# EAGLE design BMS_Master (EAGLE 6.6.0)

## Sheet 1 of 4: Processor Interface
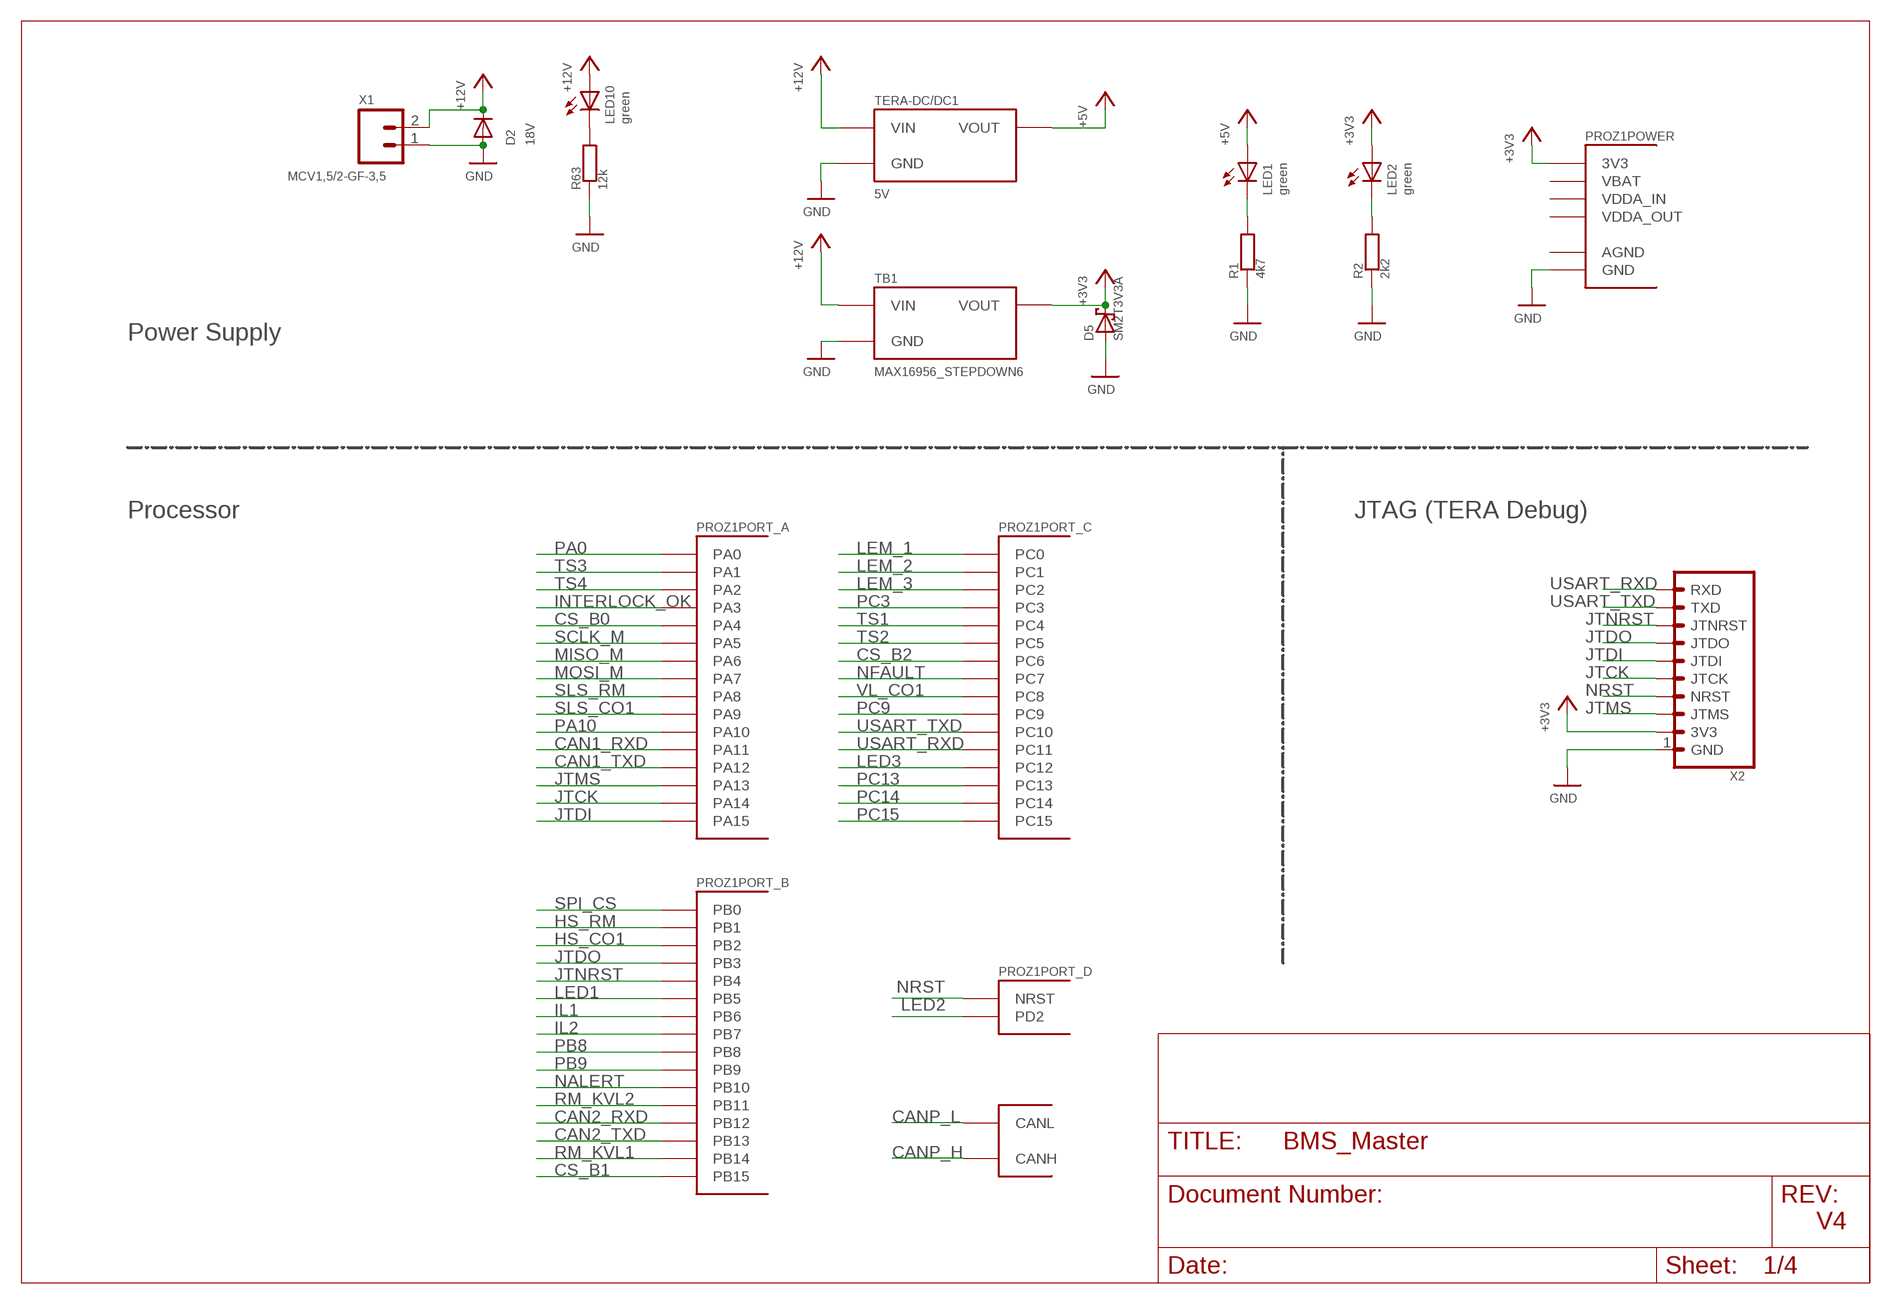
[diagram p0: schematic, sheet 1]

### Parts
D2  18V  DIODE-DO214AA  [DO214AA]
D5  SM2T3V3A  [SM2T3V3A]
LED1  green  LEDCHIP-LED0805  [CHIP-LED0805]
LED2  green  LEDCHIP-LED0805  [CHIP-LED0805]
LED10  green  LEDCHIP-LED0805  [CHIP-LED0805]
PROZ1  STM32F4_PROZESSORBOARDRPZ  [STM32F4_PROZESSORBOARD]
R1  4k7  R  [R0805]
R2  2k2  R  [R0805]
R63  12k  R  [R0805]
TB1  MAX16956_STEPDOWN6  [MAX16956_STEPDOWN6]
TERA-DC/DC1  5V  MAX5035_STEPDOWN3  [MAX5035_STEPDOWN3]
X1  MCV1,5/2-GF-3,5  [MCV1,5/2-GF-3,5]
X2  TERA-PROG-DEBUG-10GERADE  [90130-1110]

### Nets
+3V3: D5.P$2 LED2.A PROZ1.45(POWER:3V3) PROZ1.46(POWER:3V3) TB1.VOUT X2.2(3V3) ; also sheet 2,3
+5V: LED1.A TERA-DC/DC1.VOUT ; also sheet 2,3,4
+12V: D2.C LED10.A TB1.VIN TERA-DC/DC1.VIN X1.2 ; also sheet 2,3,4
CAN1_RXD: PROZ1.26(PORT_A:PA11) ; also sheet 2
CAN1_TXD: PROZ1.24(PORT_A:PA12) ; also sheet 2
CAN2_RXD: PROZ1.50(PORT_B:PB12) ; also sheet 2
CAN2_TXD: PROZ1.49(PORT_B:PB13) ; also sheet 2
CANP_H: PROZ1.31(CAN:CANH) ; also sheet 2
CANP_L: PROZ1.32(CAN:CANL) ; also sheet 2
CS_B0: PROZ1.43(PORT_A:PA4) ; also sheet 2
CS_B1: PROZ1.51(PORT_B:PB15) ; also sheet 2
CS_B2: PROZ1.52(PORT_C:PC6) ; also sheet 2
GND: D2.A D5.P$1 D5.P$11 PROZ1.47(POWER:GND) PROZ1.48(POWER:GND) R1.1 R2.1 R63.1 TB1.GND TB1.GND2(GND) TERA-DC/DC1.GND@1(GND) TERA-DC/DC1.GND@2(GND) X1.1 X2.1(GND) ; also sheet 2,3,4
HS_CO1: PROZ1.36(PORT_B:PB2) ; also sheet 3
HS_RM: PROZ1.37(PORT_B:PB1) ; also sheet 3
IL1: PROZ1.14(PORT_B:PB6) ; also sheet 3
IL2: PROZ1.12(PORT_B:PB7) ; also sheet 3
INTERLOCK_OK: PROZ1.44(PORT_A:PA3) ; also sheet 3
JTCK: PROZ1.18(PORT_A:PA14) X2.5(JTCK)
JTDI: PROZ1.16(PORT_A:PA15) X2.6(JTDI)
JTDO: PROZ1.20(PORT_B:PB3) X2.7(JTDO)
JTMS: PROZ1.59(PORT_A:PA13) X2.3(JTMS)
JTNRST: PROZ1.22(PORT_B:PB4) X2.8(JTNRST)
LED1: PROZ1.25(PORT_B:PB5)
LED2: PROZ1.27(PORT_D:PD2)
LED3: PROZ1.29(PORT_C:PC12)
LEM_1: PROZ1.15(PORT_C:PC0) ; also sheet 4
LEM_2: PROZ1.13(PORT_C:PC1) ; also sheet 4
LEM_3: PROZ1.11(PORT_C:PC2) ; also sheet 4
MISO_M: PROZ1.42(PORT_A:PA6) ; also sheet 2
MOSI_M: PROZ1.41(PORT_A:PA7) ; also sheet 2
N$1: LED1.C R1.2
N$2: LED2.C R2.2
N$54: LED10.C R63.2
NALERT: PROZ1.35(PORT_B:PB10) ; also sheet 2
NFAULT: PROZ1.53(PORT_C:PC7) ; also sheet 2
NRST: PROZ1.17(PORT_D:NRST) X2.4(NRST)
PA0: PROZ1.7(PORT_A:PA0)
PA10: PROZ1.58(PORT_A:PA10)
PB8: PROZ1.10(PORT_B:PB8)
PB9: PROZ1.8(PORT_B:PB9)
PC3: PROZ1.9(PORT_C:PC3)
PC9: PROZ1.55(PORT_C:PC9)
PC13: PROZ1.23(PORT_C:PC13)
PC14: PROZ1.21(PORT_C:PC14)
PC15: PROZ1.19(PORT_C:PC15)
RM_KVL1: PROZ1.33(PORT_B:PB14) ; also sheet 3
RM_KVL2: PROZ1.34(PORT_B:PB11) ; also sheet 3
SCLK_M: PROZ1.60(PORT_A:PA5) ; also sheet 2
SLS_CO1: PROZ1.57(PORT_A:PA9) ; also sheet 3
SLS_RM: PROZ1.56(PORT_A:PA8) ; also sheet 3
SPI_CS: PROZ1.38(PORT_B:PB0) ; also sheet 2
TS1: PROZ1.40(PORT_C:PC4) ; also sheet 4
TS2: PROZ1.39(PORT_C:PC5) ; also sheet 4
TS3: PROZ1.5(PORT_A:PA1) ; also sheet 4
TS4: PROZ1.3(PORT_A:PA2) ; also sheet 4
USART_RXD: PROZ1.30(PORT_C:PC11) X2.10(RXD)
USART_TXD: PROZ1.28(PORT_C:PC10) X2.9(TXD)
VL_CO1: PROZ1.54(PORT_C:PC8) ; also sheet 3
Unconnected: PROZ1.1(POWER:AGND) PROZ1.2(POWER:VDDA_IN) PROZ1.4(POWER:VDDA_OUT) PROZ1.6(POWER:VBAT)

### Notes on the sheet
- Power Supply
- Processor | JTAG (TERA Debug)
- V4

## Sheet 2 of 4: Bus Systems (CAN, SPI)
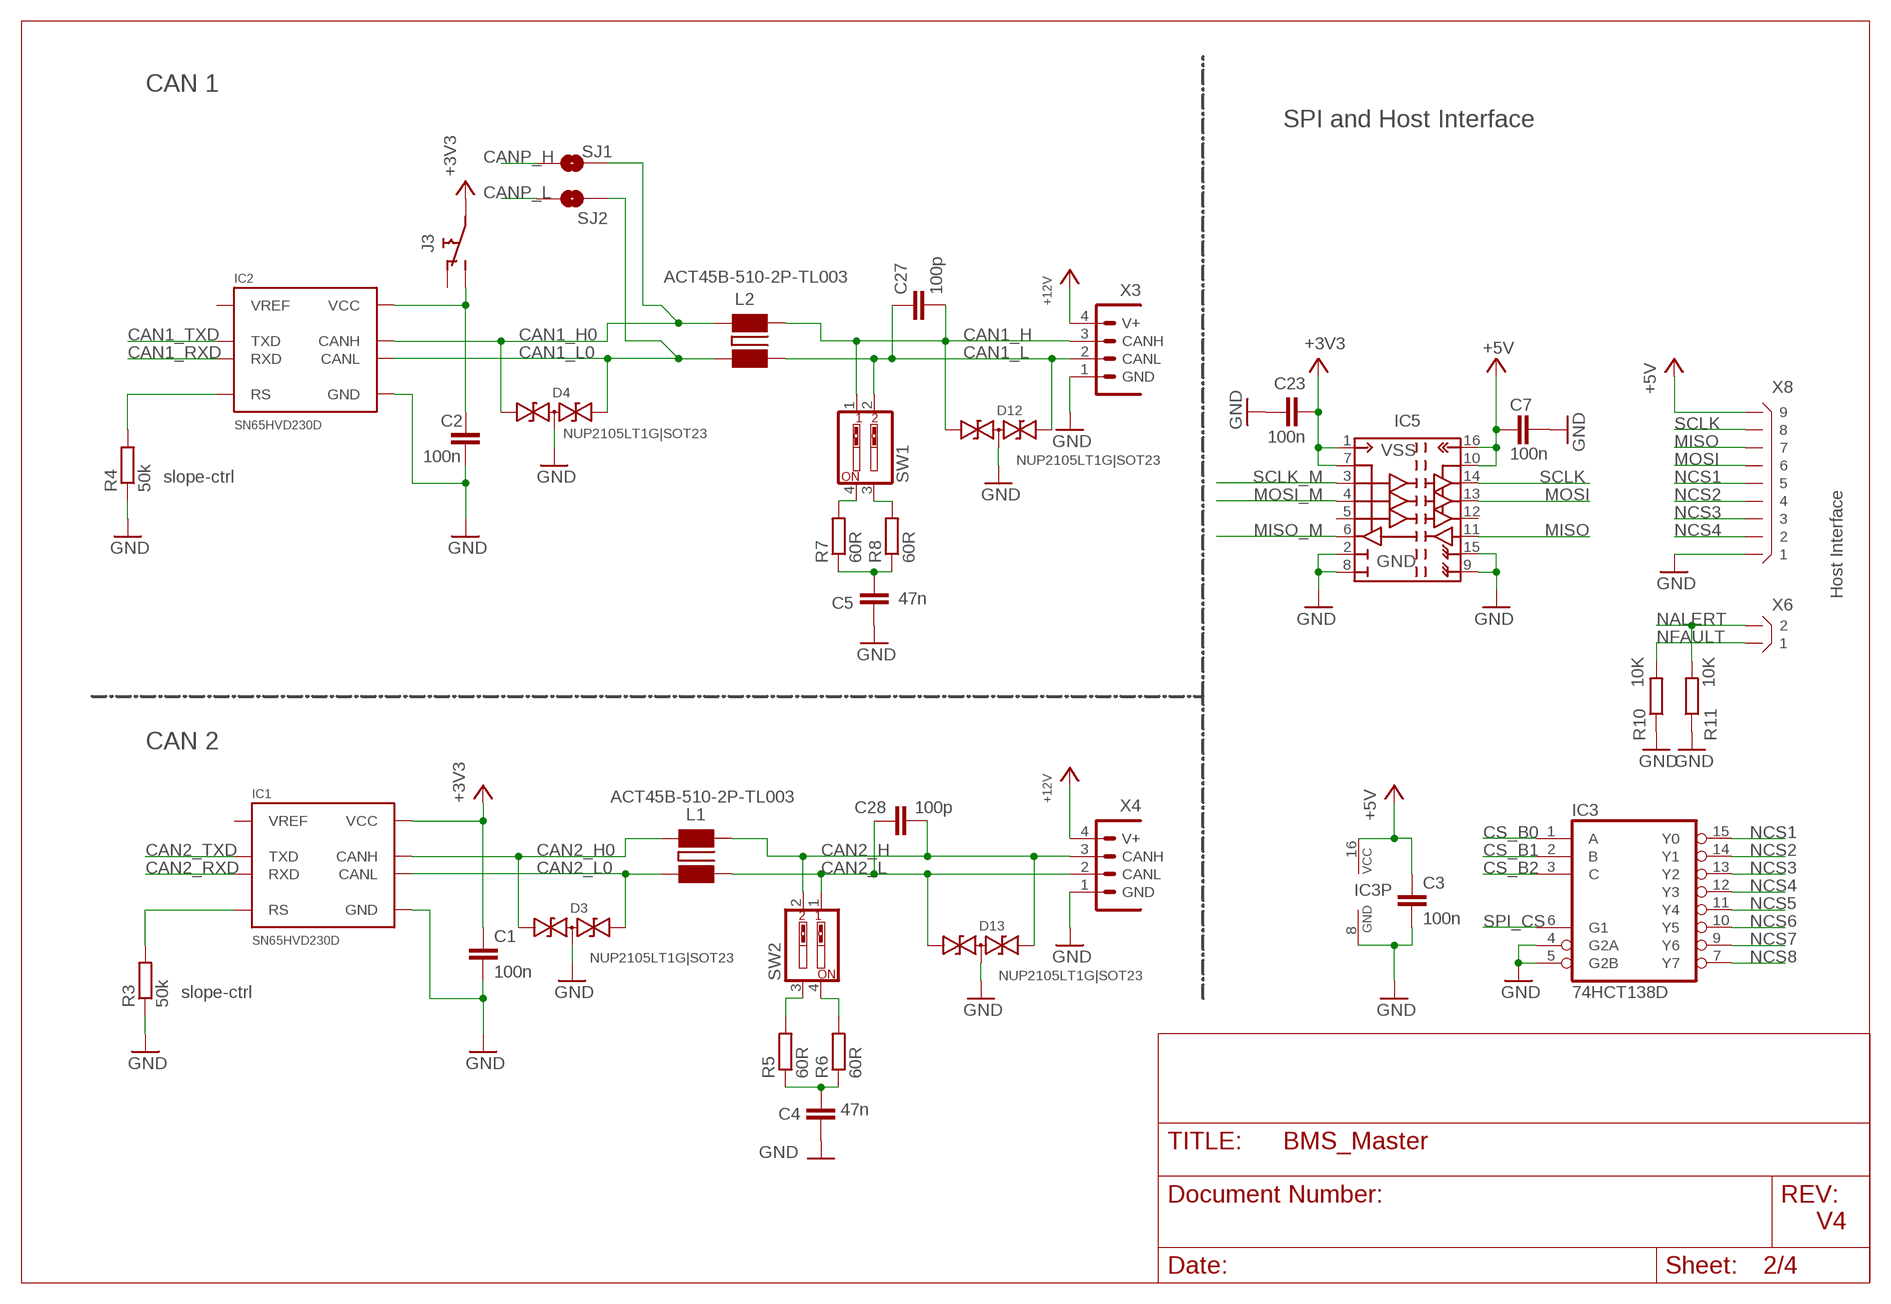
[diagram p1: schematic, sheet 2]

### Parts
C1  100n  C-EUC0805  [C0805]
C2  100n  C-EUC0805  [C0805]
C3  100n  C-EUC0805  [C0805]
C4  47n  C-EUC0603  [C0603]
C5  47n  C-EUC0603  [C0603]
C7  100n  C0603  [C0603]
C23  100n  C0603  [C0603]
C27  100p  C-EUC0603  [C0603]
C28  100p  C-EUC0603  [C0603]
D3  NUP2105LT1G|SOT23  [SOT23]
D4  NUP2105LT1G|SOT23  [SOT23]
D12  NUP2105LT1G|SOT23  [SOT23]
D13  NUP2105LT1G|SOT23  [SOT23]
IC1  SN65HVD230D  [SO08]
IC2  SN65HVD230D  [SO08]
IC3  74HCT138D  [SO16]
IC5  ISO7241  [R-PDSO-G16]
J3  JUMPER_SWITCHS  [J_OR_S]
L1  ACT45B-510-2P-TL003  [ACT45B]
L2  ACT45B-510-2P-TL003  [ACT45B]
R3  50k  R-EU_R0805  [R0805]
R4  50k  R-EU_R0805  [R0805]
R5  60R  R-EU_R0603  [R0603]
R6  60R  R-EU_R0603  [R0603]
R7  60R  R-EU_R0603  [R0603]
R8  60R  R-EU_R0603  [R0603]
R10  10K  R-EU_R0603  [R0603]
R11  10K  R-EU_R0603  [R0603]
SJ1  SOLDERJUMPERNO  [SJ_2S-NO]
SJ2  SOLDERJUMPERNO  [SJ_2S-NO]
SW1  DIP_SWITCH_DIP2  [DIPSWITCH-02]
SW2  DIP_SWITCH_DIP2  [DIPSWITCH-02]
X3  CIOC_4-1-FV-A_CAN-BELEGUNG  [CIOC_4-1-FV]
X4  CIOC_4-1-FV-A_CAN-BELEGUNG  [CIOC_4-1-FV]
X6  B2B-XH  [B2B-XH]
X8  B9B-XH  [B9B-XH]

### Nets
+3V3: C1.1 C23.2 IC1.3(VCC) IC5.1(VCC1) IC5.7(EN1) J3.P$1 ; also sheet 1,3
+5V: C3.1 C7.2 IC3.16(VCC) IC5.10(EN2) IC5.16(VCC2) X8.P$9 ; also sheet 1,3,4
+12V: X3.4(V+) X4.4(V+) ; also sheet 1,3,4
CAN1_H: C27.2 D12.1 L2.P$3 SW1.1 X3.3(CANH)
CAN1_H0: D4.1 IC2.7(CANH) L2.P$4 SJ1.1
CAN1_L: C27.1 D12.2 L2.P$1 SW1.2 X3.2(CANL)
CAN1_L0: D4.2 IC2.6(CANL) L2.P$2 SJ2.1
CAN1_RXD: IC2.4(RXD) ; also sheet 1
CAN1_TXD: IC2.1(TXD) ; also sheet 1
CAN2_H: C28.2 D13.2 L1.P$3 SW2.2 X4.3(CANH)
CAN2_H0: D3.1 IC1.7(CANH) L1.P$4
CAN2_L: C28.1 D13.1 L1.P$1 SW2.1 X4.2(CANL)
CAN2_L0: D3.2 IC1.6(CANL) L1.P$2
CAN2_RXD: IC1.4(RXD) ; also sheet 1
CAN2_TXD: IC1.1(TXD) ; also sheet 1
CANP_H: SJ1.2 ; also sheet 1
CANP_L: SJ2.2 ; also sheet 1
CS_B0: IC3.1(A) ; also sheet 1
CS_B1: IC3.2(B) ; also sheet 1
CS_B2: IC3.3(C) ; also sheet 1
GND: C1.2 C2.2 C3.2 C4.2 C5.2 C7.1 C23.1 D3.3 D4.3 D12.3 D13.3 IC1.2(GND) IC2.2(GND) IC3.4(G2A) IC3.5(G2B) IC3.8(GND) IC5.2(GND11) IC5.8(GND12) IC5.9(GND22) IC5.15(GND21) R3.1 R4.1 R10.1 R11.1 X3.1(GND) X4.1(GND) X8.P$1 ; also sheet 1,3,4
MISO: IC5.11(IN_D) X8.P$7 ; also sheet 3
MISO_M: IC5.6(OUT_D) ; also sheet 1
MOSI: IC5.13(OUT_B) X8.P$6 ; also sheet 3
MOSI_M: IC5.4(IN_B) ; also sheet 1
N$3: C5.1 R7.1 R8.1
N$15: C2.1 IC2.3(VCC) J3.P$2
N$17: IC2.8(RS) R4.2
N$18: C4.1 R5.1 R6.1
N$19: R7.2 SW1.4
N$20: IC1.8(RS) R3.2
N$21: R5.2 SW2.3
N$23: R6.2 SW2.4
N$34: R8.2 SW1.3
NALERT: R11.2 X6.P$2 ; also sheet 1
NCS1: IC3.15(Y0) X8.P$5
NCS2: IC3.14(Y1) X8.P$4
NCS3: IC3.13(Y2) X8.P$3
NCS4: IC3.12(Y3) X8.P$2
NCS5: IC3.11(Y4)
NCS6: IC3.10(Y5) ; also sheet 3
NCS7: IC3.9(Y6) ; also sheet 3
NCS8: IC3.7(Y7) ; also sheet 3
NFAULT: R10.2 X6.P$1 ; also sheet 1
SCLK: IC5.14(OUT_A) X8.P$8 ; also sheet 3
SCLK_M: IC5.3(IN_A) ; also sheet 1
SPI_CS: IC3.6(G1) ; also sheet 1
Unconnected: IC1.5(VREF) IC2.5(VREF) IC5.5(IN_C) IC5.12(OUT_C) J3.P$3

### Notes on the sheet
- CAN 1
- SPI and Host Interface
- slope-ctrl
- Host Interface
- CAN 2
- slope-ctrl
- V4

## Sheet 3 of 4: Safety Systems
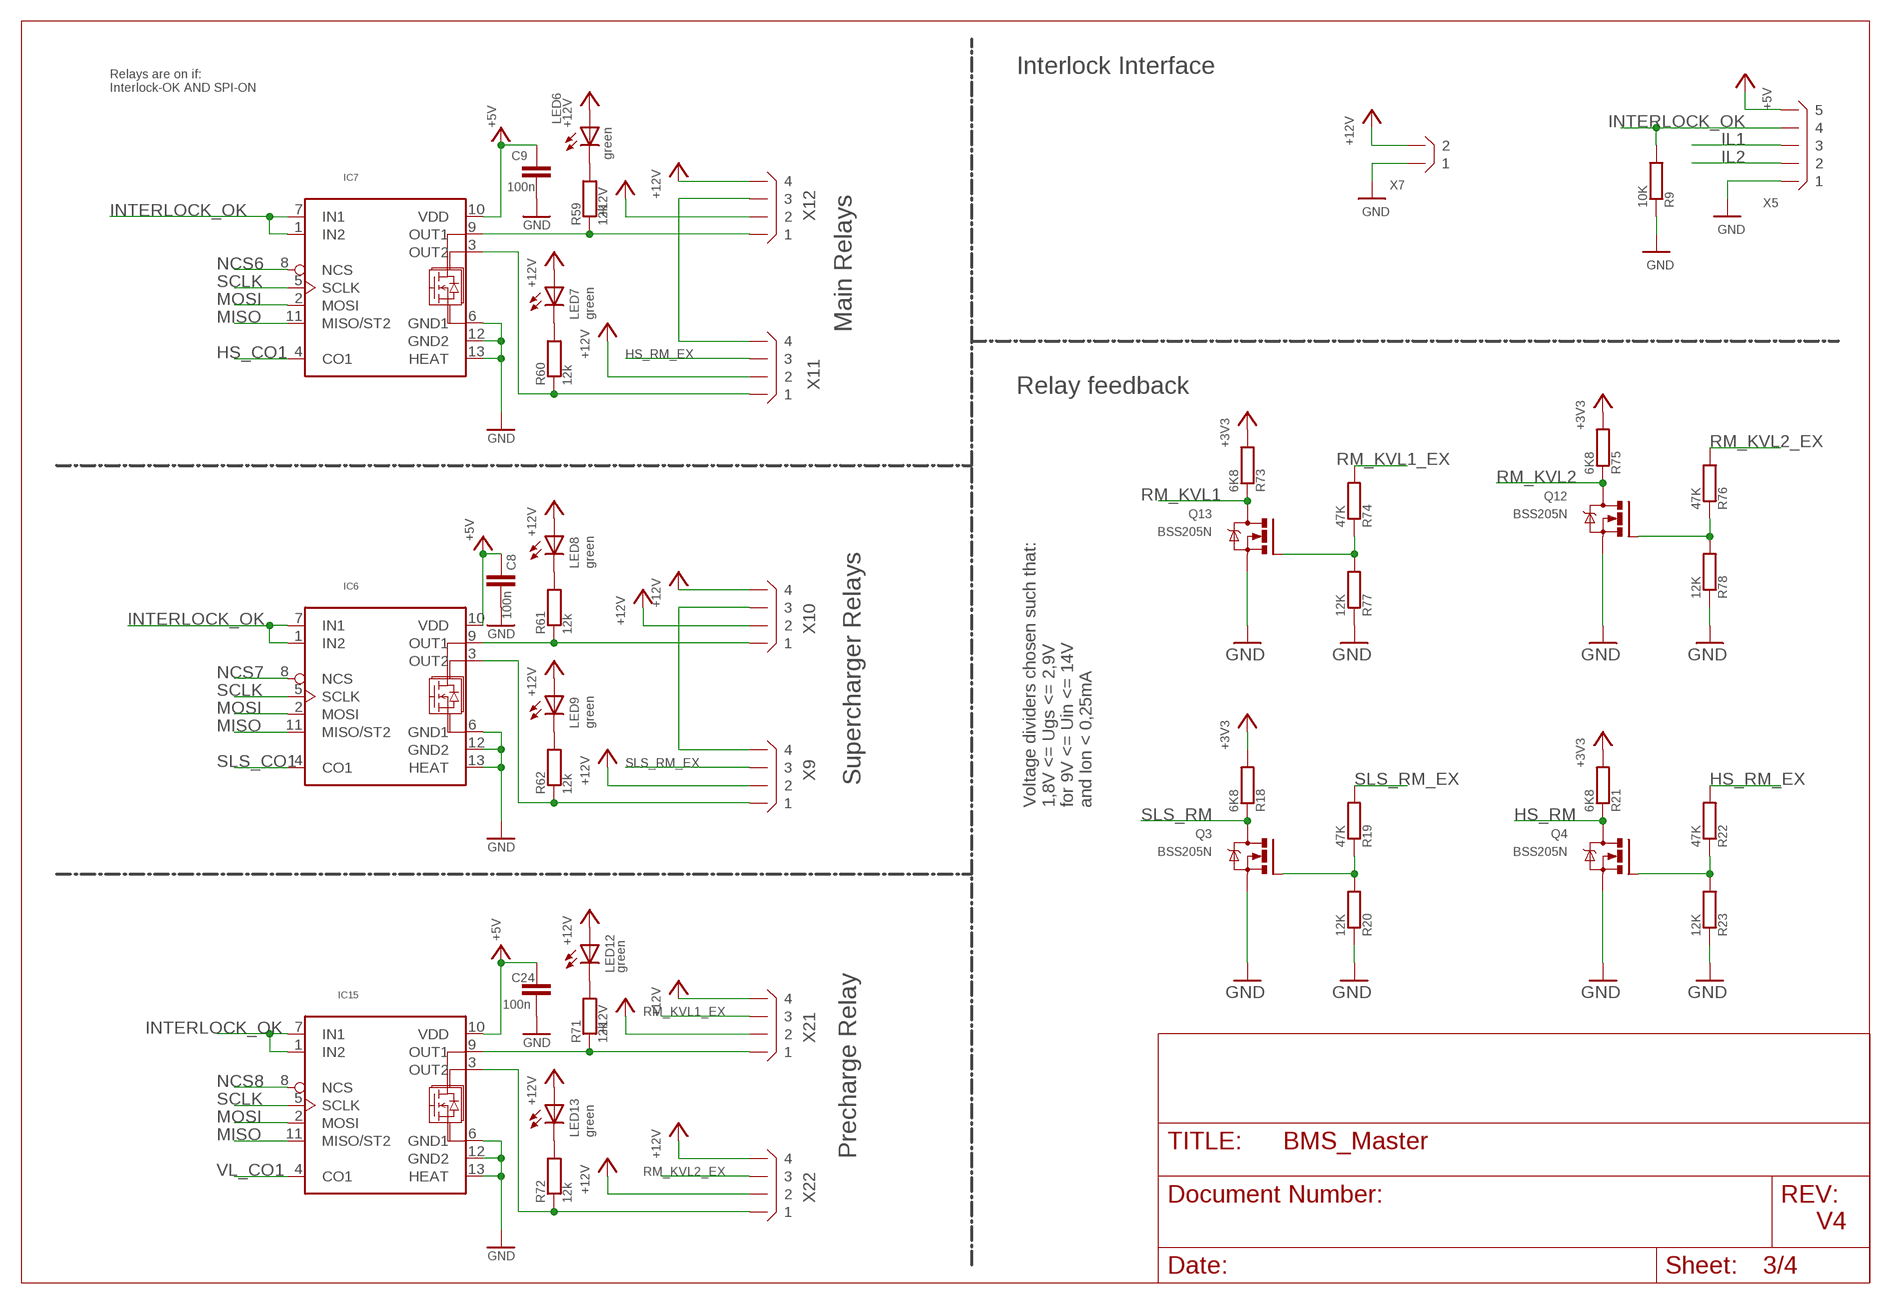
[diagram p2: schematic, sheet 3]

### Parts
C8  100n  C-EUC0603  [C0603]
C9  100n  C-EUC0603  [C0603]
C24  100n  C-EUC0603  [C0603]
IC6  TLE8102SGN  [INF-PG-DSO-12-11_N_1PRIMARY]
IC7  TLE8102SGN  [INF-PG-DSO-12-11_N_1PRIMARY]
IC15  TLE8102SGN  [INF-PG-DSO-12-11_N_1PRIMARY]
LED6  green  LEDCHIP-LED0805  [CHIP-LED0805]
LED7  green  LEDCHIP-LED0805  [CHIP-LED0805]
LED8  green  LEDCHIP-LED0805  [CHIP-LED0805]
LED9  green  LEDCHIP-LED0805  [CHIP-LED0805]
LED12  green  LEDCHIP-LED0805  [CHIP-LED0805]
LED13  green  LEDCHIP-LED0805  [CHIP-LED0805]
Q3  BSS205N  [SOT23]
Q4  BSS205N  [SOT23]
Q12  BSS205N  [SOT23]
Q13  BSS205N  [SOT23]
R9  10K  R  [R0805]
R18  6K8  R0603  [R0603]
R19  47K  R  [R0805]
R20  12K  R  [R0805]
R21  6K8  R0603  [R0603]
R22  47K  R  [R0805]
R23  12K  R  [R0805]
R59  12k  R  [R0805]
R60  12k  R  [R0805]
R61  12k  R  [R0805]
R62  12k  R  [R0805]
R71  12k  R  [R0805]
R72  12k  R  [R0805]
R73  6K8  R  [R0805]
R74  47K  R  [R0805]
R75  6K8  R  [R0805]
R76  47K  R  [R0805]
R77  12K  R  [R0805]
R78  12K  R  [R0805]
X5  B5B-XH  [B5B-XH]
X7  B2B-XH  [B2B-XH]
X9  B4B-XH  [B4B-XH]
X10  B4B-XH  [B4B-XH]
X11  B4B-XH  [B4B-XH]
X12  B4B-XH  [B4B-XH]
X21  B4B-XH  [B4B-XH]
X22  B4B-XH  [B4B-XH]

### Nets
+3V3: R18.2 R21.2 R73.2 R75.2 ; also sheet 1,2
+5V: C8.1 C9.1 C24.1 IC6.10(VDD) IC7.10(VDD) IC15.10(VDD) X5.P$5 ; also sheet 1,2,4
+12V: LED6.A LED7.A LED8.A LED9.A LED12.A LED13.A X7.P$2 X9.P$2 X10.P$2 X10.P$4 X11.P$2 X12.P$2 X12.P$4 X21.P$2 X21.P$4 X22.P$2 X22.P$4 ; also sheet 1,2,4
GND: C8.2 C9.2 C24.2 IC6.6(GND1) IC6.12(GND2) IC6.13(HEAT) IC7.6(GND1) IC7.12(GND2) IC7.13(HEAT) IC15.6(GND1) IC15.12(GND2) IC15.13(HEAT) Q3.2(S) Q4.2(S) Q12.2(S) Q13.2(S) R9.1 R20.1 R23.1 R77.1 R78.1 X5.P$1 X7.P$1 ; also sheet 1,2,4
HS_CO1: IC7.4(CO1) ; also sheet 1
HS_RM: Q4.3(D) R21.1 ; also sheet 1
HS_RM_EX: R22.2 X11.P$3
IL1: X5.P$3 ; also sheet 1
IL2: X5.P$2 ; also sheet 1
INTERLOCK_OK: IC6.1(IN2) IC6.7(IN1) IC7.1(IN2) IC7.7(IN1) IC15.1(IN2) IC15.7(IN1) R9.2 X5.P$4 ; also sheet 1
MISO: IC6.11(MISO/ST2) IC7.11(MISO/ST2) IC15.11(MISO/ST2) ; also sheet 2
MOSI: IC6.2(MOSI) IC7.2(MOSI) IC15.2(MOSI) ; also sheet 2
N$5: X9.P$4 X10.P$3
N$6: IC7.3(OUT2) R60.1 X11.P$1
N$10: IC6.9(OUT1) R61.1 X10.P$1
N$11: X11.P$4 X12.P$3
N$12: IC6.3(OUT2) R62.1 X9.P$1
N$13: IC7.9(OUT1) R59.1 X12.P$1
N$14: Q13.1(G) R74.1 R77.2
N$36: Q3.1(G) R19.1 R20.2
N$37: Q4.1(G) R22.1 R23.2
N$46: LED6.C R59.2
N$47: LED7.C R60.2
N$48: LED8.C R61.2
N$49: LED9.C R62.2
N$59: IC15.3(OUT2) R72.1 X22.P$1
N$60: IC15.9(OUT1) R71.1 X21.P$1
N$61: LED12.C R71.2
N$62: LED13.C R72.2
N$63: Q12.1(G) R76.1 R78.2
NCS6: IC7.8(NCS) ; also sheet 2
NCS7: IC6.8(NCS) ; also sheet 2
NCS8: IC15.8(NCS) ; also sheet 2
RM_KVL1: Q13.3(D) R73.1 ; also sheet 1
RM_KVL1_EX: R74.2 X21.P$3
RM_KVL2: Q12.3(D) R75.1 ; also sheet 1
RM_KVL2_EX: R76.2 X22.P$3
SCLK: IC6.5(SCLK) IC7.5(SCLK) IC15.5(SCLK) ; also sheet 2
SLS_CO1: IC6.4(CO1) ; also sheet 1
SLS_RM: Q3.3(D) R18.1 ; also sheet 1
SLS_RM_EX: R19.2 X9.P$3
VL_CO1: IC15.4(CO1) ; also sheet 1

### Notes on the sheet
- Interlock Interface
- Relays are on if:
  Interlock-OK AND SPI-ON
- Main Relays
- Relay feedback
- Supercharger Relays
- Voltage dividers chosen such that:
  1,8V <= Ugs <= 2,9V
  for 9V <= Uin <= 14V
  and Ion < 0,25mA
- Precharge Relay
- V4

## Sheet 4 of 4: Analog: - Current Measurment - Charger Temperatur
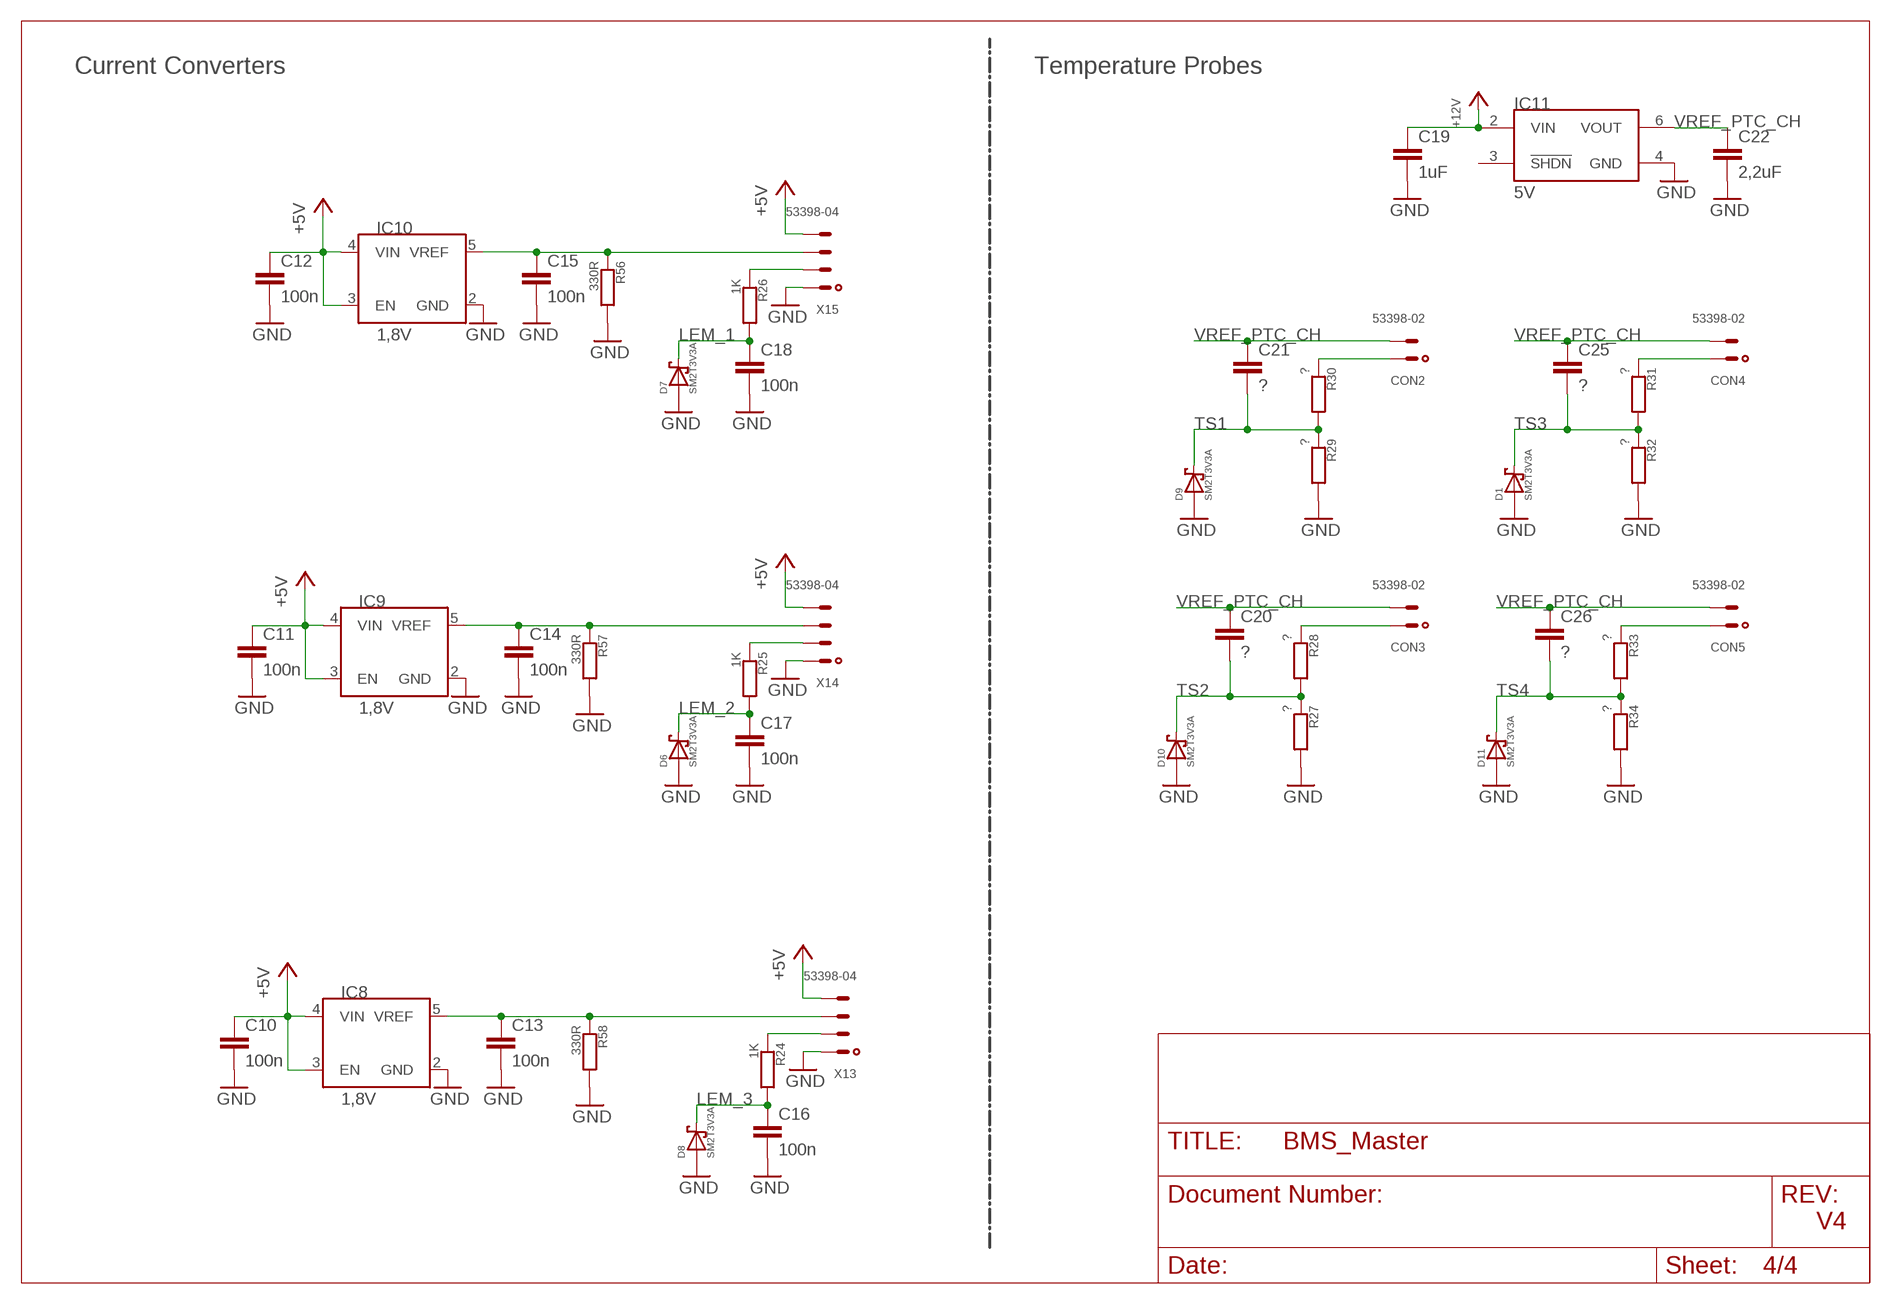
[diagram p3: schematic, sheet 4]

### Parts
C10  100n  C-EUC0805  [C0805]
C11  100n  C-EUC0805  [C0805]
C12  100n  C-EUC0805  [C0805]
C13  100n  C-EUC0805  [C0805]
C14  100n  C-EUC0805  [C0805]
C15  100n  C-EUC0805  [C0805]
C16  100n  C-EUC0805  [C0805]
C17  100n  C-EUC0805  [C0805]
C18  100n  C-EUC0805  [C0805]
C19  1uF  C-EUC0805  [C0805]
C20  ?  C-EUC0603  [C0603]
C21  ?  C-EUC0603  [C0603]
C22  2,2uF  C-EUC0805  [C0805]
C25  ?  C-EUC0603  [C0603]
C26  ?  C-EUC0603  [C0603]
CON2  53398-02  [53398-02]
CON3  53398-02  [53398-02]
CON4  53398-02  [53398-02]
CON5  53398-02  [53398-02]
D1  SM2T3V3A  [SM2T3V3A]
D6  SM2T3V3A  [SM2T3V3A]
D7  SM2T3V3A  [SM2T3V3A]
D8  SM2T3V3A  [SM2T3V3A]
D9  SM2T3V3A  [SM2T3V3A]
D10  SM2T3V3A  [SM2T3V3A]
D11  SM2T3V3A  [SM2T3V3A]
IC8  1,8V  LM4132L  [SOT23-5L]
IC9  1,8V  LM4132L  [SOT23-5L]
IC10  1,8V  LM4132L  [SOT23-5L]
IC11  5V  LT1461  [SO08]
R24  1K  R  [R0805]
R25  1K  R  [R0805]
R26  1K  R  [R0805]
R27  ?  R0603  [R0603]
R28  ?  R0603  [R0603]
R29  ?  R0603  [R0603]
R30  ?  R0603  [R0603]
R31  ?  R0603  [R0603]
R32  ?  R0603  [R0603]
R33  ?  R0603  [R0603]
R34  ?  R0603  [R0603]
R56  330R  R  [R0805]
R57  330R  R  [R0805]
R58  330R  R  [R0805]
X13  53398-04  [53398-04]
X14  53398-04  [53398-04]
X15  53398-04  [53398-04]

### Nets
+5V: C10.1 C11.1 C12.1 IC8.3(EN) IC8.4(VIN) IC9.3(EN) IC9.4(VIN) IC10.3(EN) IC10.4(VIN) X13.4 X14.4 X15.4 ; also sheet 1,2,3
+12V: C19.1 IC11.2(VIN) ; also sheet 1,2,3
GND: C10.2 C11.2 C12.2 C13.2 C14.2 C15.2 C16.2 C17.2 C18.2 C19.2 C22.2 D1.P$1 D1.P$11 D6.P$1 D6.P$11 D7.P$1 D7.P$11 D8.P$1 D8.P$11 D9.P$1 D9.P$11 D10.P$1 D10.P$11 D11.P$1 D11.P$11 IC8.2(GND) IC9.2(GND) IC10.2(GND) IC11.4(GND) R27.2 R29.2 R32.2 R34.2 R56.2 R57.2 R58.2 X13.1 X14.1 X15.1 ; also sheet 1,2,3
LEM_1: C18.1 D7.P$2 R26.2 ; also sheet 1
LEM_2: C17.1 D6.P$2 R25.2 ; also sheet 1
LEM_3: C16.1 D8.P$2 R24.2 ; also sheet 1
N$4: C13.1 IC8.5(VREF) R58.1 X13.3
N$7: R26.1 X15.2
N$9: C14.1 IC9.5(VREF) R57.1 X14.3
N$16: CON4.1 R31.1
N$22: CON5.1 R33.1
N$25: CON2.1 R30.1
N$31: R25.1 X14.2
N$32: C15.1 IC10.5(VREF) R56.1 X15.3
N$33: R24.1 X13.2
N$35: CON3.1 R28.1
TS1: C21.2 D9.P$2 R29.1 R30.2 ; also sheet 1
TS2: C20.2 D10.P$2 R27.1 R28.2 ; also sheet 1
TS3: C25.2 D1.P$2 R31.2 R32.1 ; also sheet 1
TS4: C26.2 D11.P$2 R33.2 R34.1 ; also sheet 1
VREF_PTC_CH: C20.1 C21.1 C22.1 C25.1 C26.1 CON2.2 CON3.2 CON4.2 CON5.2 IC11.6(VOUT)
Unconnected: IC11.3(!SHDN)

### Notes on the sheet
- Current Converters | Temperature Probes
- V4

## Library data of the parts
C1-C5 C8-C22 C24-C28 = rcl:C-EU: CAPACITOR, European symbol
C7 C23 = useful:C
CON2-CON5 = con-molex:53?-02: CONNECTOR wire to board 1.25 mm (.049 inch) pitch header
D1 D5-D11 = st:SM2T3V3A: ST2T3V3A Low voltage TransilTM
D2 = diode:DIODE-: DIODE
D3 D4 D12 D13 = diode:NUP2105LT1G: DIODE, CAN BUS Protector NUP2105LT1G
IC1 IC2 = ti:SN65HVD23*D: 3v3 powered CAN Transeiver by TI with Slope control and reference voltage; POWER_SLEEP_MODE: no
IC3 = 74xx-eu:74*138: 3-line to 8-line DECODER/DEMULTIPLEXER
IC5 = ti:ISO7241
IC6 IC7 IC15 = infineon:TLE8102SG
IC8-IC10 = ti:LM4132
IC11 = linear:LT1461
J3 = jumper:JUMPER_SWITCH
L1 L2 = epcos:ACT45B-510-2P-TL003: Common mode choke SMD 51uH 200mA CAN bus; DISTR: RS-Components; ORDERNR: 774-0544
LED1 LED2 LED6-LED10 LED12 LED13 = led:LED: LED OSRAM: - CHIPLED LG R971, LG N971, LY N971, LG Q971, LY Q971, LO R971, LY R971 LH N974, LH R974 LS Q976, LO Q976, LY Q976 LO Q996 - Hyper CHIPLED LW Q18S LB Q993, LB Q99A, LB R99A - SideLED LS A670, LO A670, LY A670, LG A670, LP A670 LB A673, LV A673, LT A673, LW A673 LH A674 LY A675 LS A676, LA A676, LO A676, LY A676, LW A676 LS A679, LY A679, LG A679 - Hyper Micro SIDELED® LS Y876, LA Y876, LO Y876, LY Y876 LT Y87S - SmartLED LW L88C, LW L88S LB L89C, LB L89S, LG L890 LS L89K, LO L89K, LY L89K LS L896, LA L896, LO L896, LY L896 - TOPLED LS T670, LO T670, LY T670, LG T670, LP T670 LSG T670, LSP T670, LSY T670, LOP T670, LYG T670 LG T671, LOG T671, LSG T671 LB T673, LV T673, LT T673, LW T673 LH T674 LS T676, LA T676, LO T676, LY T676, LB T676, LH T676, LSB T676, LW T676 LB T67C, LV T67C, LT T67C, LS T67K, LO T67K, LY T67K, LW E67C LS E67B, LA E67B, LO E67B, LY E67B, LB E67C, LV E67C, LT E67C LW T67C LS T679, LY T679, LG T679 LS T770, LO T770, LY T770, LG T770, LP T770 LB T773, LV T773, LT T773, LW T773 LH T774 LS E675, LA E675, LY E675, LS T675 LS T776, LA T776, LO T776, LY T776, LB T776 LHGB T686 LT T68C, LB T68C - Hyper Mini TOPLED® LB M676 - Mini TOPLED Santana® LG M470 LS M47K, LO M47K, LY M47K Source: http://www.osram.convergy.de LUXEON: - LUMILED® LXK2-PW12-R00, LXK2-PW12-S00, LXK2-PW14-U00, LXK2-PW14-V00 LXK2-PM12-R00, LXK2-PM12-S00, LXK2-PM14-U00 LXK2-PE12-Q00, LXK2-PE12-R00, LXK2-PE12-S00, LXK2-PE14-T00, LXK2-PE14-U00 LXK2-PB12-K00, LXK2-PB12-L00, LXK2-PB12-M00, LXK2-PB14-N00, LXK2-PB14-P00, LXK2-PB14-Q00 LXK2-PR12-L00, LXK2-PR12-M00, LXK2-PR14-Q00, LXK2-PR14-R00 LXK2-PD12-Q00, LXK2-PD12-R00, LXK2-PD12-S00 LXK2-PH12-R00, LXK2-PH12-S00 LXK2-PL12-P00, LXK2-PL12-Q00, LXK2-PL12-R00 Source: www.luxeon.com KINGBRIGHT: KA-3528ASYC Source: www.kingbright.com
PROZ1 = tera-boards:STM32F4_PROZESSORBOARD
Q3 Q4 Q12 Q13 = infineon:BSS205N: Infineon Small Signal Transistor, OptiMOS 2 Technology, 20V, 2.5A SOT23
R1 R2 R9 R18-R34 R56-R63 R71-R78 = useful:R
R3-R8 R10 R11 = rcl:R-EU_: RESISTOR, European symbol
SJ1 SJ2 = useful:SOLDERJUMPER: Solder Jumper Standard SMD solder jumper. Used to automate production. Two varients : Normally Open and Normally Closed are the same, but have different paste layers. NC will have a large amount of paste and should jumper during reflow.
SW1 SW2 = te-electronics:DIP_SWITCH_DIP2: TE - 1825360-1 TE - 1825002-1
TB1 = tera-boards:MAX16956_STEPDOWN6
TERA-DC/DC1 = tera-boards:MAX5035_STEPDOWN3
X1 = con-phoenix:MCV1,5/2-GF-3,5
X2 = useful:TERA-PROG-DEBUG-10: TERA-Prog-Debug Connector 10-Pol
X3 X4 = con-phoenix:CIOC_4-1-FV-A_CAN-BELEGUNG: CIOC_4-1-FV-A mit Bezeichnungen für CAN-Signale und Versorgungen; MANUF: Phoenix-Contact; ORDERNR: 1701388
X5 = con-jst-xh:?5B-XH
X6 X7 = con-jst-xh:?2B-XH
X8 = con-jst-xh:?9B-XH
X9-X12 X21 X22 = con-jst-xh:?4B-XH
X13-X15 = con-molex:53?-04: CONNECTOR wire to board 1.25 mm (.049 inch) pitch header

## Board
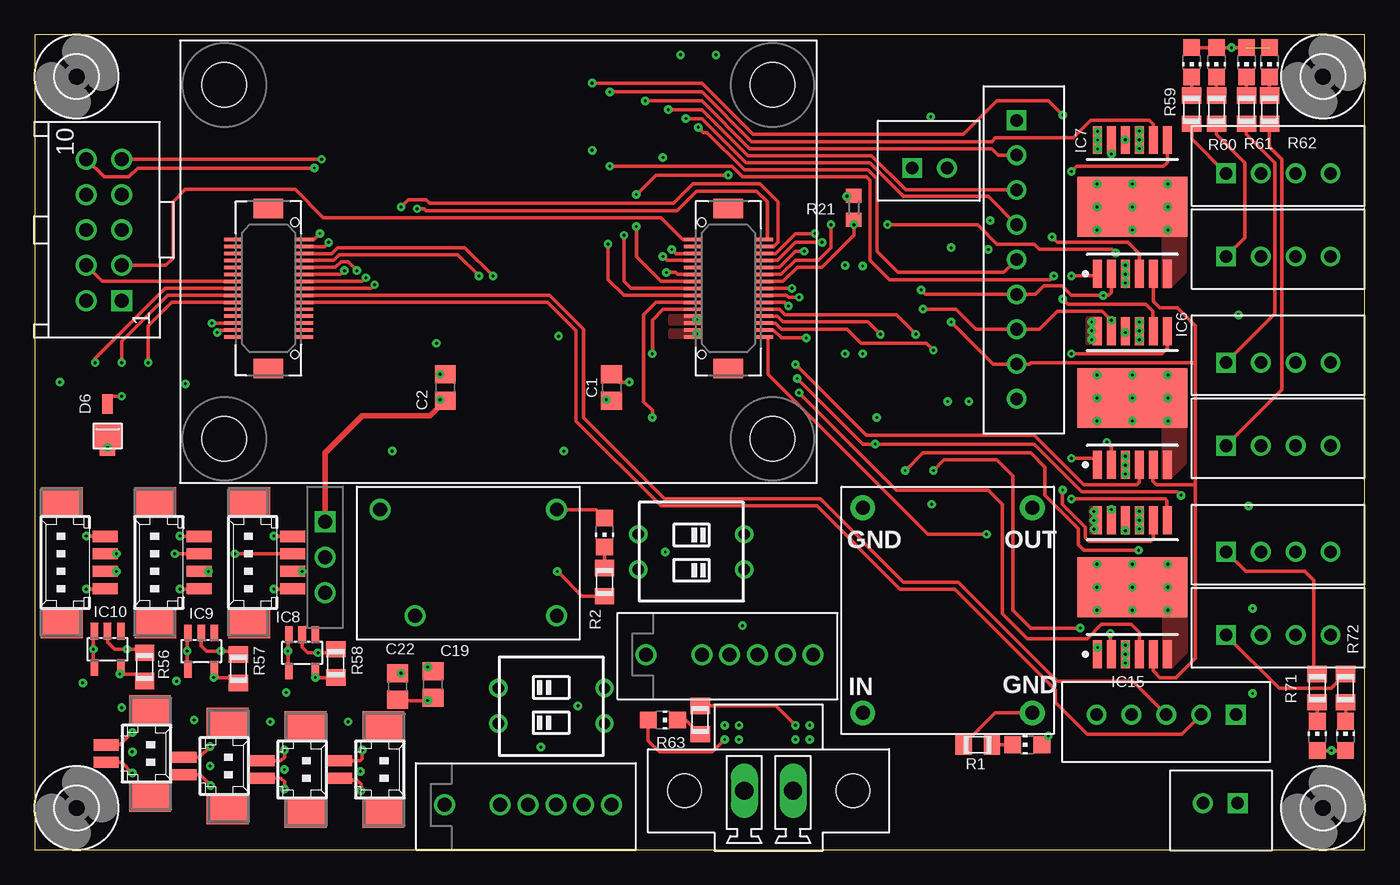
[diagram p4: board, top side]
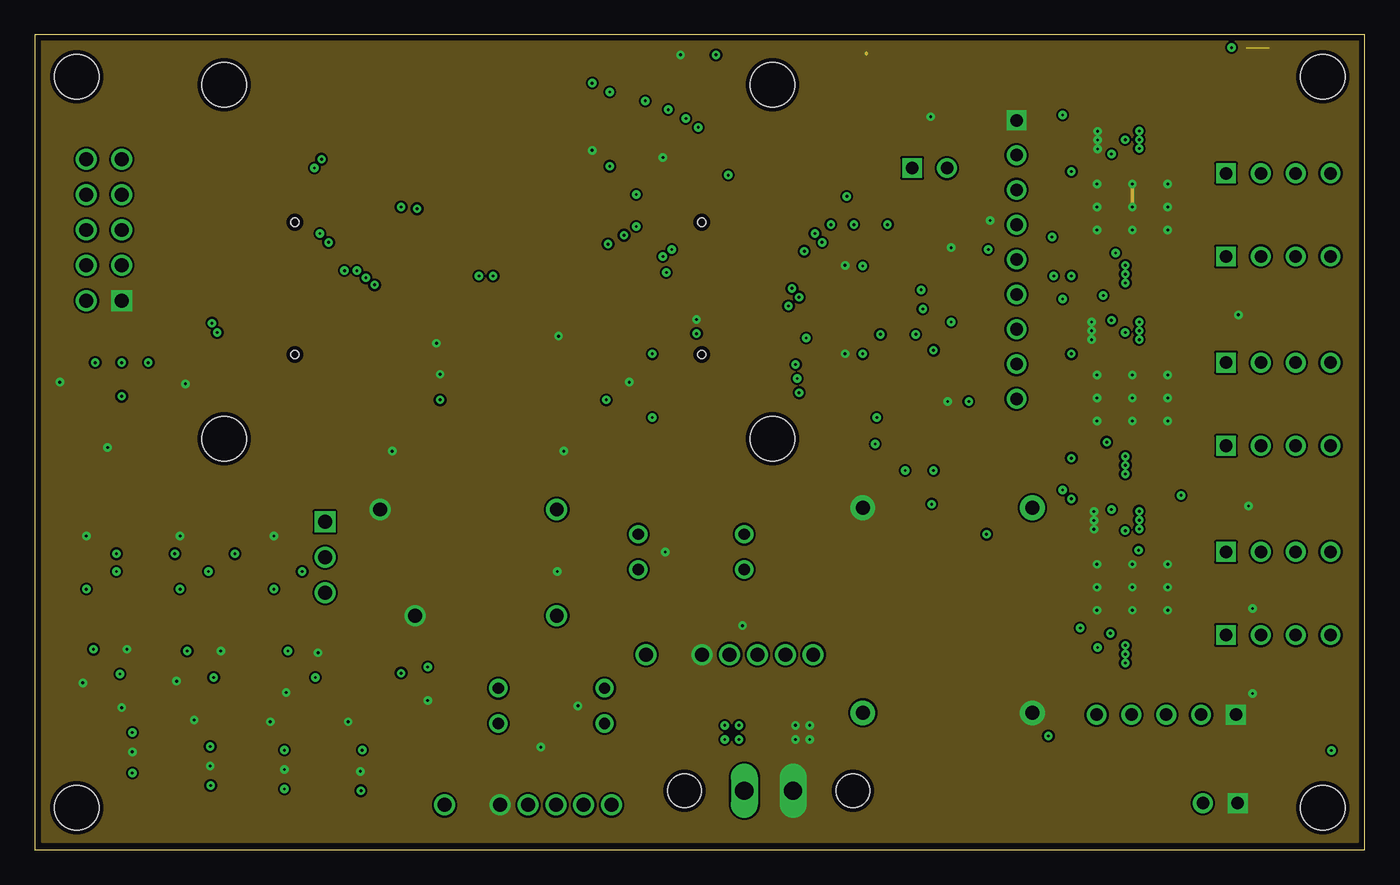
[diagram p5: board, inner layer Route2]
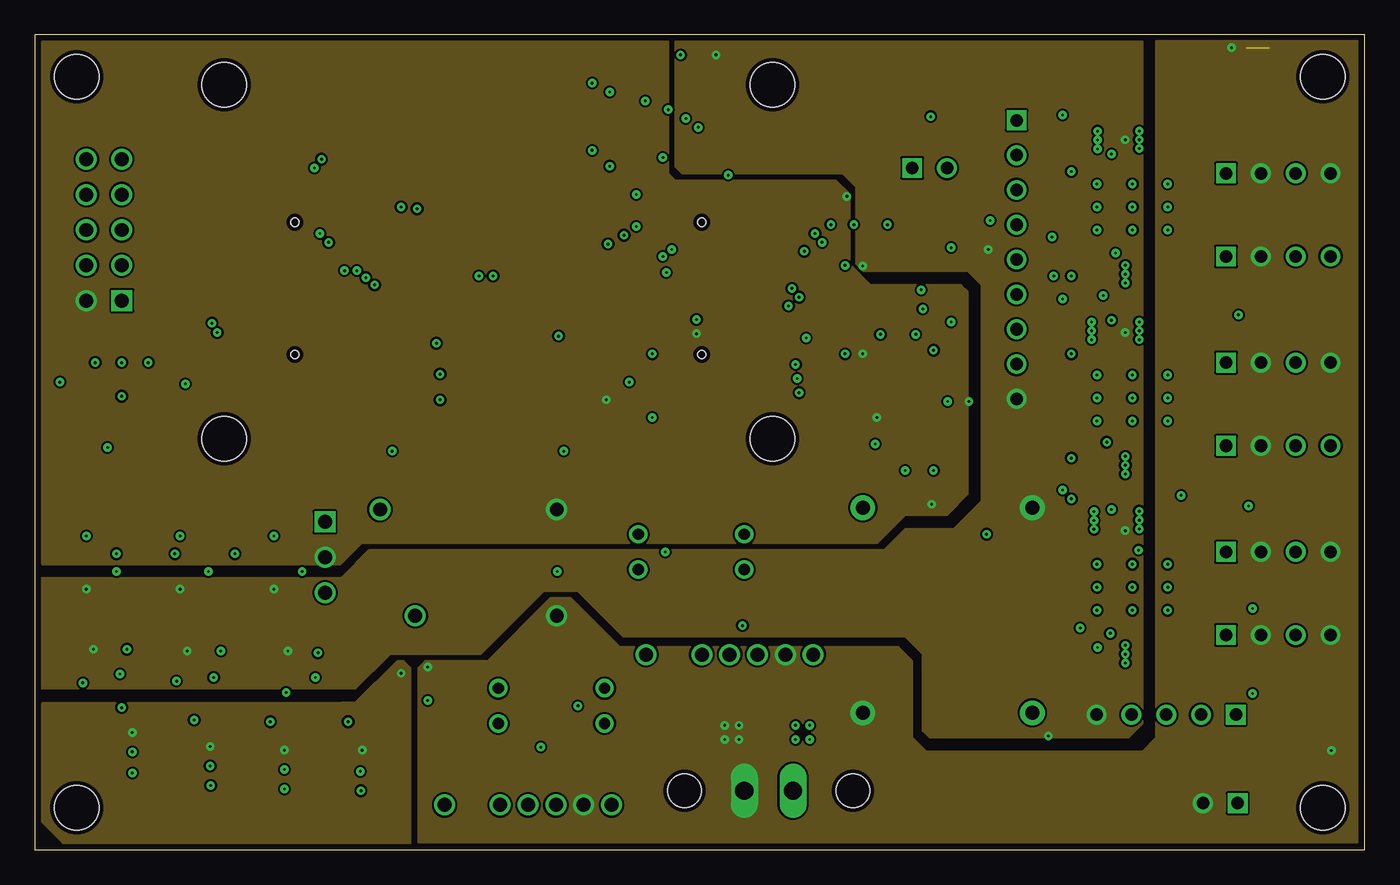
[diagram p6: board, inner layer Route15]
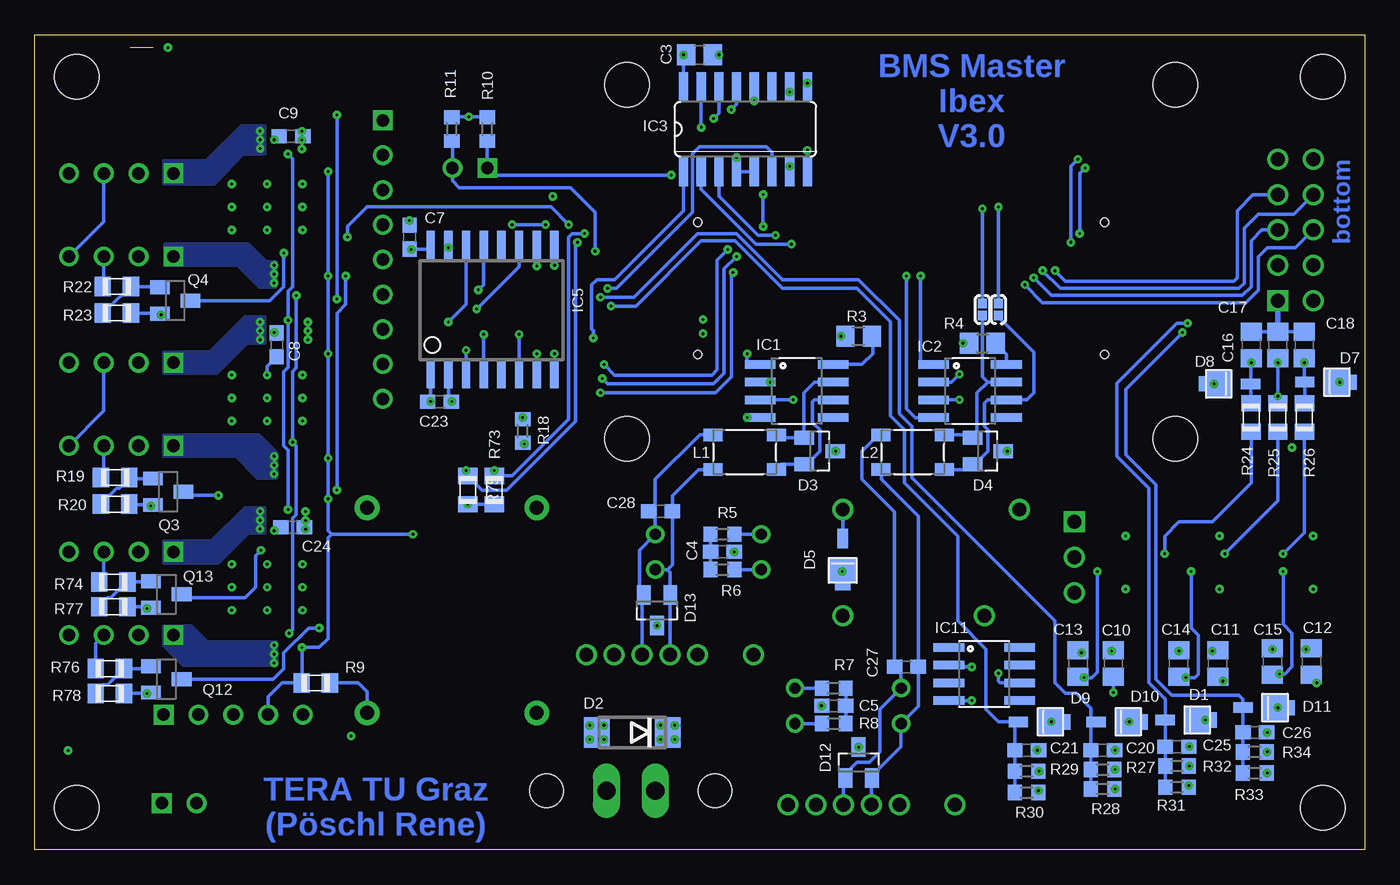
[diagram p7: board, bottom side, seen from below]

Size 95.5 x 58.5 mm. Coordinates in mm from the lower left corner, seen from the top.
Outline: 0,0 95.5,0 95.5,58.5 0,58.5 0,0
Copper layers (1+2*15+16): Top 0.035mm / dielectric 0.2mm / Route2 0.035mm / dielectric 0.5mm / Route15 0.035mm / dielectric 0.2mm / Bottom 0.035mm
Design rules "ats_35u_4layer *": minimum track width 6mil, minimum drill 0.2mm, track to track 6mil, track to pad 6mil, pad to pad 6mil, via to via 6mil, smd to smd 6mil, copper to edge 0.3mm, drill to drill 8mil, minimum pad ring 10mil, minimum via ring 0.2mm, stop-mask expansion 4mil, vias tented up to drill 0mil, thermal gap 10mil

### Footprints (pad centres in the part's own frame; a part is rotated, then mirrored left to right if it is on the bottom)
C0805 = smd 1.3 x 1.5: 1 -0.95,0; 2 0.95,0
C0603 = smd 1.1 x 1: 1 -0.85,0; 2 0.85,0
53398-02 = smd 0.8 x 1.8: 1 0.625,-2.5; 2 -0.625,-2.5 | smd 2.1 x 3: S1 3.125,0.625; S2 -3.125,0.625
SM2T3V3A = smd 1.82 x 2.03: P$1 -1.21,0 | smd 1.38 x 0.75: P$2 1.1,0 | smd 0.5 x 1.1: P$11 -2.37,0.005
DO214AA = smd 1.8 x 2.2: A 2.55,0; C -2.55,0
SOT23 = smd 1 x 1.4: 1 -0.95,-1.1; 2 0.95,-1.1; 3 0,1.1
3,2 = hole 3.2: 0,0
SO08 = smd 0.61 x 2.21: 1 -1.905,-2.616; 2 -0.635,-2.616; 3 0.635,-2.616; 4 1.905,-2.616; 5 1.905,2.616; 6 0.635,2.616; 7 -0.635,2.616; 8 -1.905,2.616
SO16 = smd 0.66 x 2.032: 1 -4.445,-3.073; 2 -3.175,-3.073; 3 -1.905,-3.073; 4 -0.635,-3.073; 5 0.635,-3.073; 6 1.905,-3.073; 7 3.175,-3.073; 8 4.445,-3.073; 9 4.445,3.073; 10 3.175,3.073; 11 1.905,3.073; 12 0.635,3.073; 13 -0.635,3.073; 14 -1.905,3.073; 15 -3.175,3.073; 16 -4.445,3.073
R-PDSO-G16 = smd 0.6 x 2: 1 -3.937,-4.649; 2 -2.667,-4.649; 3 -1.397,-4.649; 4 -0.127,-4.649; 5 1.143,-4.649; 6 2.413,-4.649; 7 3.683,-4.649; 8 4.953,-4.649; 9 4.953,4.651; 10 3.683,4.651; 11 2.413,4.651; 12 1.143,4.651; 13 -0.127,4.651; 14 -1.397,4.651; 15 -2.667,4.651; 16 -3.937,4.651
INF-PG-DSO-12-11_N_1PRIMARY = smd 2 x 0.65: 1 -4.8,2.5; 2 -4.8,1.5; 3 -4.8,0.5; 4 -4.8,-0.5; 5 -4.8,-1.5; 6 -4.8,-2.5; 7 4.8,-2.5; 8 4.8,-1.5; 9 4.8,-0.5; 10 4.8,0.5; 11 4.8,1.5; 12 4.8,2.5 | smd 4.3 x 7.9: 13 0,0
SOT23-5L = smd 0.55 x 1.2: 1 -0.95,-1.3; 2 0,-1.3; 3 0.95,-1.3; 4 0.95,1.3; 5 -0.95,1.3
SO08' = smd 0.61 x 2.21: 1 -1.905,-2.54; 2 -0.635,-2.54; 3 0.635,-2.54; 4 1.905,-2.54; 5 1.905,2.54; 6 0.635,2.54; 7 -0.635,2.54; 8 -1.905,2.54
J_OR_S = drill 1: P$1 2.54,0; P$3 5.08,0 | drill 1 square: P$2 0,0
ACT45B = smd 1.35 x 0.9: P$1 -0.675,0.45; P$2 3.875,0.45; P$3 -0.675,2.95; P$4 3.875,2.95
CHIP-LED0805 = smd 1.2 x 1.2: A 0,-1.05; C 0,1.05
STM32F4_PROZESSORBOARD = smd 1.2 x 0.25: 1 3.75,10.47; 2 8.95,10.47; 3 3.75,10.97; 4 8.95,10.97; 5 3.75,11.47; 6 8.95,11.47; 7 3.75,11.97; 8 8.95,11.97; 9 3.75,12.47; 10 8.95,12.47; 11 3.75,12.97; 12 8.95,12.97; 13 3.75,13.47; 14 8.95,13.47; 15 3.75,13.97; 16 8.95,13.97; 17 3.75,14.47; 18 8.95,14.47; 19 3.75,14.97; 20 8.95,14.97; 21 3.75,15.47; 22 8.95,15.47; 23 3.75,15.97; 24 8.95,15.97; 25 3.75,16.47; 26 8.95,16.47; 27 3.75,16.97; 28 8.95,16.97; 29 3.75,17.47; 30 8.95,17.47; 31 41.97,17.47; 32 41.97,16.97; 33 41.97,16.47; 34 41.97,15.97; 35 41.97,15.47; 36 41.97,14.97; 37 41.97,14.47; 38 41.97,13.97; 39 41.97,13.47; 40 41.97,12.97; 41 41.97,12.47; 42 41.97,11.97; 43 41.97,10.97; 44 41.97,10.47; 45 36.77,10.47; 46 36.77,10.97; 47 36.77,11.47; 48 36.77,11.97; 49 36.77,12.47; 50 36.77,12.97; 51 36.77,13.47; 52 36.77,13.97; 53 36.77,14.47; 54 36.77,14.97; 55 36.77,15.47; 56 36.77,15.97; 57 36.77,16.47; 58 36.77,16.97; 59 36.77,17.47; 60 41.97,11.47 | smd 2.1 x 1.4: M1 6.35,8.22; M2 6.35,19.72; M3 39.37,8.22; M4 39.37,19.72 | hole 3.2: 3.175,3.175; 3.175,28.575; 42.545,28.575; 42.545,3.175 | hole 0.6: 8.25,9.22; 8.25,18.72; 37.47,18.72; 37.47,9.22
R0805 = smd 1.168 x 1.397: 1 -1.016,0; 2 1.016,0
R0805' = smd 1.3 x 1.5: 1 -0.95,0; 2 0.95,0
R0603 = smd 1 x 1.1: 1 -0.85,0; 2 0.85,0
SJ_2S-NO = smd 0.686 x 0.635: 1 -0.425,0; 2 0.425,0
DIPSWITCH-02 = drill 0.813: 1 -1.27,-3.81; 2 1.27,-3.81; 3 1.27,3.81; 4 -1.27,3.81
MAX16956_STEPDOWN6 = drill 1: GND 14.351,1.651; GND2 11.811,9.271; VIN 1.651,9.271; VOUT 1.651,1.651
MAX5035_STEPDOWN3 = drill 1 pad 1.778: GND@1 1.524,16.256; GND@2 13.716,1.524; VIN 1.524,1.524; VOUT 13.716,16.256
MCV1,5/2-GF-3,5 = drill 1.3 long: 1 0,3.5; 2 0,0 | hole 2.4: 0,7.8; 0,-4.3
90130-1110 = drill 1 square: 1 -5.08,-1.27 | drill 1: 2 -5.08,1.27; 3 -2.54,-1.27; 4 -2.54,1.27; 5 0,-1.27; 6 0,1.27; 7 2.54,-1.27; 8 2.54,1.27; 9 5.08,-1.27; 10 5.08,1.27
CIOC_4-1-FV = drill 1: 1 0,0; 2 2,0; 3 4,0; 4 6,0; 5 -4,0; 6 8,0
B5B-XH = drill 0.9 pad 1.422 square: P$1 0,0 | drill 0.9 pad 1.422: P$2 2.5,0; P$3 5,0; P$4 7.5,0; P$5 10,0
B2B-XH = drill 0.9 pad 1.422 square: P$1 0,0 | drill 0.9 pad 1.422: P$2 2.5,0
B9B-XH = drill 0.9 pad 1.422 square: P$1 0,0 | drill 0.9 pad 1.422: P$2 2.5,0; P$3 5,0; P$4 7.5,0; P$5 10,0; P$6 12.5,0; P$7 15,0; P$8 17.5,0; P$9 20,0
B4B-XH = drill 0.9 pad 1.422 square: P$1 0,0 | drill 0.9 pad 1.422: P$2 2.5,0; P$3 5,0; P$4 7.5,0
53398-04 = smd 0.8 x 1.8: 1 1.875,-2.5; 2 0.625,-2.5; 3 -0.625,-2.5; 4 -1.875,-2.5 | smd 2.1 x 3: S1 4.375,0.625; S2 -4.375,0.625

### Placement (x,y rotation side)
C1  41.42,33.19 90 top
C2  29.48,33.19 90 top
C3  47.77,57.06 0 bottom
C4  46.12,21.38 0 bottom
C5  38.12,10.33 180 bottom
C7  68.6,43.98 270 bottom
C8  78.12,36.24 270 bottom
C9  77.11,51.22 0 bottom
C10  18.05,13.38 270 bottom
C11  10.56,13.38 270 bottom
C12  3.83,13.5 270 bottom
C13  20.59,13.38 90 bottom
C14  13.35,13.38 90 bottom
C15  6.62,13.5 90 bottom
C16  8.15,36.24 90 bottom
C17  6.24,36.24 90 bottom
C18  4.34,36.24 90 bottom
C19  28.59,11.85 270 top
C20  18.81,7.15 180 bottom
C21  24.28,7.15 180 bottom
C22  26.05,11.72 270 top
C23  66.44,32.17 180 bottom
C24  76.98,23.16 0 bottom
C25  13.48,7.41 180 bottom
C26  7.89,8.42 180 bottom
C27  32.91,13.12 180 bottom
C28  50.56,24.3 180 bottom
CON2  24.4,5.76 270 top
CON3  18.81,5.76 270 top
CON4  13.23,6.01 270 top
CON5  7.64,6.9 270 top
D1  13.23,9.31 180 bottom
D2  52.6,8.42 180 bottom
D3  39.13,28.62 270 bottom
D4  27.07,28.62 270 bottom
D5  37.48,21.25 90 bottom
D6  5.22,30.9 90 top
D7  3.19,33.57 180 bottom
D8  9.29,33.44 0 bottom
D9  23.77,9.19 180 bottom
D10  18.18,9.19 180 bottom
D11  7.64,10.2 180 bottom
D12  36.34,6.26 0 bottom
D13  50.82,17.19 180 bottom
H1  MOUNT-HOLE3.2  [3,2]  92.5,3 0 top
H2  MOUNT-HOLE3.2  [3,2]  3,3 0 top
H3  MOUNT-HOLE3.2  [3,2]  92.5,55.5 0 top
H4  MOUNT-HOLE3.2  [3,2]  3,55.5 0 top
IC1  40.79,32.93 270 bottom
IC2  28.34,32.93 270 bottom
IC3  44.47,51.73 0 bottom
IC5  63.14,38.78 0 bottom
IC6  78.81,32.43 90 top
IC7  78.81,46.15 90 top
IC8  19.2,14.14 180 top
IC9  11.96,14.27 180 top
IC10  5.22,14.39 180 top
IC11  5V  [SO08']  27.32,12.61 270 bottom
IC15  78.81,18.84 90 top
J3  20.85,23.54 270 top
L1  46.12,26.84 0 bottom
L2  34.05,26.84 0 bottom
LED1  71.27,7.53 90 top
LED2  40.91,22.77 180 top
LED6  83.08,56.53 180 top
LED7  84.85,56.53 180 top
LED8  87.01,56.53 180 top
LED9  88.66,56.53 180 top
LED10  45.1,9.31 270 top
LED12  92.09,8.17 0 top
LED13  94.12,8.17 0 top
PROZ1  10.43,26.33 0 top
Q3  85.93,25.7 270 bottom
Q4  85.42,39.41 270 bottom
Q12  86.05,12.24 270 bottom
Q13  86.05,18.33 270 bottom
R1  67.71,7.53 0 top
R2  40.91,19.22 90 top
R3  50k  [R0805']  36.34,36.87 0 bottom
R4  50k  [R0805']  27.45,36.36 0 bottom
R5  46.12,22.65 0 bottom
R6  46.12,20.11 0 bottom
R7  38.12,11.6 180 bottom
R8  38.12,9.06 180 bottom
R9  75.33,11.98 180 bottom
R10  63.01,51.73 270 bottom
R11  65.55,51.73 270 bottom
R18  60.47,30.07 90 bottom
R19  89.74,26.71 180 bottom
R20  89.74,24.81 180 bottom
R21  58.81,46.09 90 top
R22  89.61,40.43 180 bottom
R23  89.61,38.53 180 bottom
R24  8.15,31.03 90 bottom
R25  6.24,31.03 90 bottom
R26  4.34,31.03 90 bottom
R27  18.81,5.76 0 bottom
R28  18.81,4.36 180 bottom
R29  24.28,5.63 0 bottom
R30  24.28,4.11 180 bottom
R31  13.48,4.49 180 bottom
R32  13.48,6.01 0 bottom
R33  7.89,5.5 180 bottom
R34  7.89,7.03 0 bottom
R56  7.89,13.12 90 top
R57  14.62,13 90 top
R58  21.61,13.38 90 top
R59  83.08,53.13 90 top
R60  84.85,53.13 90 top
R61  87.01,53.13 90 top
R62  88.66,53.13 90 top
R63  47.77,9.31 270 top
R71  92.09,11.6 270 top
R72  94.12,11.6 270 top
R73  62.5,25.82 270 bottom
R74  89.86,19.22 180 bottom
R75  64.41,25.82 270 bottom
R76  90.12,13 180 bottom
R77  89.86,17.44 180 bottom
R78  90.12,11.22 180 bottom
SJ1  27.45,38.78 90 bottom
SJ2  26.31,38.78 90 bottom
SW1  37.1,10.33 270 top
SW2  47.13,21.38 90 top
TB1  39.13,26.08 180 top
TERA-DC/DC1  57.93,8.3 0 top
X1  50.95,4.23 270 top
X2  4.97,44.49 90 top
X3  33.42,3.22 0 top
X4  47.9,14.01 0 top
X5  86.25,9.69 180 top
X6  63.01,48.94 0 top
X7  86.38,3.34 180 top
X8  70.5,52.36 270 top
X9  85.55,29 0 top
X10  85.55,34.97 0 top
X11  85.55,42.59 0 top
X12  85.55,48.56 0 top
X13  16.02,20.62 90 top
X14  9.29,20.62 90 top
X15  2.56,20.62 90 top
X21  85.55,21.38 0 top
X22  85.55,15.41 0 top

### Tracks (layer width: path | path; a pad name or v marks a point on that pad's centre or on a via)
+3V3  (via drill 0.2)
  Top 0.254: R21.2 58.81,46.9 v58.31,46.9 | C1.1 41.48,32.3 v41.04,32.3 | LED2.A 40.31,24.43 TB1.VOUT
  Bottom 0.254: v59.45,35.6 IC5.7 | 60.34,30.91 R18.2 v60.47,31.03 | IC5.1 v67.07,32.17 C23.2 | v41.04,32.3 IC1.3 | R73.2 R75.2 | D5.P$2 TB1.VOUT
  other vias: 47.52,37.05 64.4,24.81
  pour Route15 (isolate 0.152, no thermals): 0.5,20.5 21.98,20.5 23.52,22.04 60.5,22.03 62.49,24.03 65.52,24.04 67.02,25.54 67.02,40.04 66.52,40.54 60.02,40.54 58.52,42.04 58.52,47.04 57.52,48.04 46.02,48.04 45.52,48.54 45.52,58 0.5,58
  pour Top (no thermals): 47.82,36.79 45.61,36.79 45.61,37.3 47.82,37.3
+5V  (via drill 0.2)
  Top 0.254: IC6.10 78.31,37.22 v78.31,37.13 | IC10.4 4.21,13.16 v4.21,14.39 4.21,15.63 IC10.3 | IC9.4 10.94,13.03 v10.94,14.27 10.94,15.5 IC9.3 | IC8.3 18.18,15.37 v18.18,14.27 18.18,12.9 IC8.4 | X13.4 17.83,18.74 17.8,18.71 v17.16,18.71 | X14.4 11.22,18.74 11.19,18.71 v10.43,18.71 | X15.4 4.37,18.74 4.34,18.71 v3.7,18.71 | v78.31,50.97 78.31,50.94 IC7.10 | v78.31,22.91 78.31,23.63 IC15.10 | LED1.A 72.66,8.04 v72.79,8.17
  Bottom 0.254: 4.02,14.45 C12.1 3.89,14.39 v4.21,14.39 | C11.1 10.88,14.33 v10.94,14.27 | v18.18,14.27 18.11,14.27 C10.1 | IC5.16 67.07,43.09 v68.47,43.09 68.69,43.13 C7.2 | IC5.10 v59.45,41.91 | v78.31,37.13 78.12,37.13 C8.1 | v78.31,50.97 IC7.10 78.31,50.95 v78.31,50.97 78.06,51.22 C9.1 | C24.1 78.31,23.16 v78.31,22.91 | IC3.16 48.91,56.87 | v48.91,57.06 48.91,56.87 | 48.91,56.87 C3.1
  pour Route15 (isolate 0.152, no thermals): 46.02,58.04 79.52,58.04 79.52,9.04 78.52,8.04 64.27,8.04 63.77,8.54 63.77,14.04 62.52,15.29 42.27,15.29 39.02,18.54 36.52,18.54 32.02,14.04 25.52,14.04 23.02,11.54 0.52,11.54 0.52,19.54 22.02,19.54 24.02,21.54 61.02,21.54 62.52,23.04 66.02,23.04 68.02,25.04 68.02,40.54 67.02,41.54 59.52,41.54 59.02,42.04 59.02,47.54 58.02,48.54 46.52,48.54 46.02,49.04
+12V  (via drill 0.2)  (1 unrouted)
  Top 0.254: LED6.A LED7.A v85.93,57.58 LED8.A | LED12.A v93.11,7.12 LED13.A | C19.1 28.21,12.8 v28.21,13.12 | LED10.A 44.05,7.82 44.85,7.03 48.66,7.03 v49.55,7.92
  Bottom 0.254: v49.55,7.92 50.05,7.92 D2.C | IC11.2 29.74,13.12 v28.21,13.12
  other vias: 49.55,8.93 50.56,8.93 50.56,7.92
  pour Route15 (isolate 0.152, no thermals): 95.02,0.54 95.02,58.04 80.52,58.04 80.52,8.04 79.52,7.04 64.02,7.04 63.02,8.04 63.02,13.54 62.02,14.54 42.02,14.54 38.52,18.04 37.02,18.04 32.52,13.54 28.02,13.54 27.52,13.04 27.52,0.54
CAN1_H
  Bottom 0.254: X3.3 37.42,5.04 D12.1 37.1,5.35 37.1,5.63 36.47,6.26 35.58,6.26 34.82,7.03 34.82,10.07 SW1.1 33.29,12.65 C27.2 33.76,24.26 36.09,26.58 36.09,28.62 35.2,29.5 35.01,29.5 L2.P$3
CAN1_H0
  Bottom 0.254: D4.1 28.39,29.79 | 28.39,29.79 L2.P$4 | SJ1.1 27.45,33.95 27.07,33.57 | 27.07,33.57 IC2.7 | 28.39,29.79 27.83,29.79 27.83,32.81 27.07,33.57
CAN1_L
  Bottom 0.254: X3.2 35.42,5.14 D12.2 35.07,5.48 35.07,5.63 33.29,7.41 SW1.2 32.06,10.29 C27.1 32.06,23.96 34.69,26.58 34.69,27.25 L2.P$1
CAN1_L0
  Bottom 0.254: L2.P$2 28.55,27.29 D4.2 28.02,27.67 27.07,28.62 27.07,30.14 27.32,30.39 27.32,32.04 27.07,32.3 IC2.6 24.28,32.3 23.77,32.81 23.77,35.73 26.31,38.27 SJ2.1
CAN1_RXD  (via drill 0.2)
  Top 0.254: v32.91,41.19 30.88,43.22 21.73,43.22 21.31,42.8 PROZ1.26
  Bottom 0.254: IC2.4 32.28,31.03 32.91,31.66 v32.91,41.19
CAN1_TXD  (via drill 0.2)
  Top 0.254: v31.89,41.19 30.37,42.71 21.86,42.71 21.45,42.3 PROZ1.24
  Bottom 0.254: v31.89,41.19 31.89,34.79 31.01,34.79 IC2.1
CAN2_H
  Bottom 0.254: X4.3 51.9,18.16 D13.2 51.77,18.52 52.09,18.84 52.09,21.5 SW2.2 50.95,23.83 C28.2 50.95,24.77 50.95,26.58 47.74,29.79 L1.P$3
CAN2_H0
  Bottom 0.254: IC1.7 39.52,33.57 40.28,32.81 40.28,29.61 D3.1 42.02,29.57 L1.P$4
CAN2_L
  Bottom 0.254: X4.2 49.9,18.26 D13.1 49.87,19.92 50.06,20.11 | SW2.1 50.06,20.11 | 50.06,20.11 49.71,20.45 C28.1 49.71,25.4 47.83,27.29 L1.P$1
CAN2_L0
  Bottom 0.254: IC1.6 39.52,32.3 39.64,32.17 39.64,30.65 39.13,30.14 39.13,28.62 40.08,27.67 D3.2 41.87,27.67 L1.P$2
CAN2_RXD  (via drill 0.2)
  Top 0.254: PROZ1.50 44.61,39.3 43.71,38.39 43.71,32.17 44.34,31.54 v44.34,31.03
  Bottom 0.254: v44.34,31.03 IC1.4
CAN2_TXD  (via drill 0.2)
  Top 0.254: PROZ1.49 45.13,38.8 44.34,38.01 v44.34,35.6
  Bottom 0.254: v44.34,35.6 44.34,34.84 IC1.1
CANP_H  (via drill 0.2)
  Top 0.254: PROZ1.31 52.6,43.8 52.6,46.52 51.83,47.28 47.52,47.28 46.12,45.89 28.09,45.89 27.96,46.01 v27.45,46.01
  Bottom 0.254: SJ1.2 v27.45,46.01
CANP_L  (via drill 0.2)
  Top 0.254: PROZ1.32 53.06,43.3 53.36,43.6 53.36,46.52 52.09,47.79 47.26,47.79 45.87,46.4 28.34,46.4 28.09,46.65 26.82,46.65 v26.31,46.14
  Bottom 0.254: SJ2.2 v26.31,46.14
CS_B0  (via drill 0.2)
  Top 0.254: v55.39,36.74 53.61,36.74 53.06,37.3 PROZ1.43
  Bottom 0.254: 49.04,49.57 48.91,49.44 IC3.1 48.91,45.89 53.87,40.93 55.14,40.93 55.52,40.55 55.52,37.38 55.39,37.25 v55.39,36.74
CS_B1  (via drill 0.2)
  Top 0.254: PROZ1.51 42.3,39.8 41.17,40.93 v41.17,43.47
  Bottom 0.254: IC3.2 47.64,47.41 43.71,43.47 v41.17,43.47
CS_B2  (via drill 0.2)
  Top 0.254: PROZ1.52 42.82,40.3 42.31,40.81 v42.31,44.11
  Bottom 0.254: IC3.3 46.37,46.9 43.58,44.11 v42.31,44.11
GND  (via drill 0.2)
  Top 0.254: IC7.13 77.04,46.15 76.31,46.87 | X15.1 4.75,22.49 4.72,22.52 v3.7,22.52 | X14.1 11.61,22.49 11.58,22.52 v10.43,22.52 | X13.1 18.08,22.49 18.05,22.52 v17.16,22.52 | IC8.2 19.2,14.52 19.58,14.14 v20.34,14.14 21.35,14.14 R58.2 | IC9.2 11.96,14.65 12.34,14.27 v13.35,14.27 14.37,14.27 R57.2 | IC10.2 5.22,14.9 5.73,14.39 v6.62,14.39 7.64,14.39 R56.2 | 76.27,50.91 v76.31,50.95 | D6.P$11 v5.22,28.87 D6.P$1 4.99,29.93 | IC6.12 76.31,37.17 76.15,37 | IC15.6 81.31,13.25 81.35,13.25 | 81.31,27.6 IC6.6 | C1.2 41.99,33.57 v42.69,33.57 | C19.2 28.4,10.71 v28.21,10.71 26.12,10.71 C22.2 | R63.1 53.23,10.33 v54.63,8.93 | C2.2 v29.1,34.14 | R1.1 68.98,9.82 TERA-DC/DC1.GND@2 | R2.1 39.3,18.2 v37.52,19.98
  Route2 0.254: v78.81,47.8 IC7.13 | 59.71,57.19 59.71,57.15
  Bottom 0.254: v54.63,7.92 55.15,7.92 D2.A | IC1.2 v42.69,33.57 | R3.1 v37.61,36.87 | R4.1 v28.85,36.36 | IC3.5 IC3.4 v45.1,49.7 | v6.62,14.39 6.56,14.39 C15.2 | v13.35,14.27 13.29,14.27 C14.2 | v20.34,14.14 20.4,14.14 C13.2 | C16.2 C17.2 C18.2 4.27,37.12 3.7,37.12 | 39.92,48.66 IC3.8 v40.02,50.21 | C3.2 v46.37,57.06 | v10.18,12.11 10.24,12.11 C11.2 | v3.45,11.98 3.45,12.17 C12.2 | R78.1 v87.45,11.22 87.22,11.22 Q12.2 | Q13.2 87.38,17.38 v87.45,17.32 87.58,17.44 R77.1 | R23.1 86.58,38.53 Q4.2 86.5,38.46 v86.43,38.4 | C8.2 78.81,34.7 v78.81,34.08 | C24.2 76.13,23.08 v76.06,23.01 | R20.1 88.66,24.75 Q3.2 87.09,24.68 v87.16,24.68 | IC5.15 v65.8,43.22 | v58.18,35.6 IC5.8 | IC5.9 v58.18,41.95 | C7.1 v68.6,45.17 | IC5.2 65.8,32.51 65.59,32.3 C23.1 v65.55,32.17 | D7.P$1 v1.8,33.57 v1.79,33.56 D7.P$11 | D8.P$1 v10.81,33.44 v10.82,33.45 D8.P$11 | 76.31,50.97 v76.31,50.95 76.26,51 C9.2 | D3.3 v37.99,28.62 | IC11.4 v28.21,10.71 | D9.P$11 23.31,9.18 D9.P$1 v22.5,9.19 | D11.P$11 v6.24,10.2 D11.P$1 | R34.2 v7,7.03 | R32.2 v12.59,6.01 | D1.P$11 v11.45,9.31 D1.P$1 | D10.P$11 v16.91,9.19 D10.P$1 | R27.2 v17.93,5.76 | R29.2 v23.39,5.63 | C5.2 v39,10.33 | C10.2 v18.05,11.29 | IC2.2 29.67,33.57 v29.1,34.14 | D5.P$11 37.49,19.95 v37.52,19.98 37.36,20.02 D5.P$1 | R9.1 72.28,11.98 71.65,11.34 TERA-DC/DC1.GND@2 | R11.1 65.55,52.62 v64.34,52.62 63.01,52.62 R10.1
  Bottom 0.406: C17.2 X2.1 | D4.3 v25.67,28.62
  other vias: 47.52,38.06 55.64,8.93 55.64,7.92 76.27,44.49 78.81,44.49 81.35,44.49 81.35,46.15 81.35,47.8 78.81,46.15 76.27,47.8 76.27,46.15 78.81,30.78 78.81,32.43 81.35,30.78 81.35,32.43 81.35,34.08 76.27,30.78 76.27,32.43 76.27,34.08 76.27,17.19 81.35,17.19 81.35,18.84 81.35,20.49 78.81,20.49 76.27,18.84 78.81,17.19 78.81,18.84 76.27,20.49 75.89,36.62 75.89,37.26 75.89,37.89 76.06,23.64 76.06,24.28 76.31,51.58 76.31,50.31 45.27,21.38 50.82,16.09 36.34,7.36
  pour Top (no thermals): 47.82,37.76 45.61,37.76 45.61,38.32 47.82,38.32
  pour Route2 (isolate 0.152, no thermals): 0.52,0.54 0.52,58.04 95.02,58.04 95.02,0.54
  pour Top (no thermals): 82.62,17.57 82.62,14.14 81.61,13.13 81.1,13.13 81.1,17.57
  pour Top (no thermals): 76.47,38.14 75.58,38.14 75.58,36.36 76.47,36.36
  pour Top (no thermals): 76.47,24.55 75.84,24.55 75.84,22.77 76.47,22.77
  pour Top (no thermals): 81.04,31.16 82.57,31.16 82.57,27.73 81.55,26.71 81.04,26.71
  pour Top (no thermals): 81.04,44.87 82.57,44.87 82.57,41.44 81.55,40.43 81.04,40.43
HS_CO1  (via drill 0.2)
  Top 0.254: PROZ1.36 53.6,41.3 54.63,42.33 56.28,42.33 57.17,43.22 v57.17,44.87 | IC7.4 79.31,42.79 78.5,43.6 73.42,43.6 v73.04,43.98
  Bottom 0.254: v73.04,43.98 73.04,44.74 71.65,46.14 58.44,46.14 v57.17,44.87
HS_RM  (via drill 0.2)
  Top 0.254: PROZ1.37 53.73,40.8 54.76,41.82 56.53,41.82 58.82,44.11 v58.82,44.87 v58.81,44.88 R21.1 | v61.23,44.87 67.71,44.87 69.11,43.47 71.77,43.47 72.15,43.09 77.36,43.09 v77.61,42.84
  Bottom 0.254: v77.61,42.84 77.61,40.43 78.63,39.41 Q4.3 | v61.23,44.87 v58.82,44.87
HS_RM_EX
  Bottom 0.254: X11.P$3 90.55,40.51 R22.2
IL1
  Top 0.254: PROZ1.14 36.97,39.8 39.39,37.38 39.39,31.03 45.23,25.19 56.41,25.19 62.38,19.22 66.31,19.22 73.42,12.11 78.84,12.11 X5.P$3
IL2
  Top 0.254: PROZ1.12 36.83,39.3 38.88,37.25 38.88,30.78 44.98,24.68 56.15,24.68 62.12,18.71 66.06,18.71 73.3,11.47 73.3,10.58 75.58,8.3 82.35,8.3 X5.P$2
INTERLOCK_OK  (via drill 0.2)
  Top 0.254: v74.44,48.68 74.82,49.06 81.04,49.06 81.31,49.33 IC7.7 | IC6.7 81.31,36 80.92,35.6 v74.44,35.6 | v74.44,41.19 76.31,41.19 IC7.1 76.21,41.45 | v76.31,14.52 IC15.1 | IC15.7 81.3,23.66 81.3,25.06 81.17,25.19 v74.44,25.19 | v74.44,28.11 76.31,28.11 IC6.1 | PROZ1.44 52.66,36.8 52.66,34.14 64.15,22.65 v68.34,22.65
  Bottom 0.254: v74.44,48.68 v74.44,41.19 v74.44,35.6 v74.44,28.11 v74.44,25.19 74.44,22.9 74.19,22.65 | 74.19,22.65 v68.34,22.65 | 74.19,22.65 74.44,22.39 74.44,15.15 75.08,14.52 v76.31,14.52 76.31,12.01 R9.2 77.74,11.98 78.75,10.97 X5.P$4
JTCK  (via drill 0.2)
  Top 0.254: PROZ1.18 23.5,40.8 v23.77,41.06
  Bottom 0.254: v23.77,41.06 22.5,39.79 8.78,39.79 8.15,40.43 8.15,43.73 7.38,44.49 X2.5
JTDI  (via drill 0.2)
  Top 0.254: PROZ1.16 24.15,40.3 v24.4,40.55
  Bottom 0.254: X2.6 4.97,43.22 7,43.22 7.64,42.59 7.64,40.17 8.53,39.28 23.13,39.28 v24.4,40.55
JTDO  (via drill 0.2)
  Top 0.254: PROZ1.20 21.97,41.3 v22.24,41.57
  Bottom 0.254: X2.7 8.02,47.03 9.16,45.89 9.16,41.06 9.42,40.81 21.48,40.81 v22.24,41.57
JTMS
  Top 0.254: X2.3 9.42,41.95 9.92,42.46 9.92,46.52 10.81,47.41 18.69,47.41 20.72,45.38 44.98,45.38 46.56,43.8 PROZ1.59
JTNRST  (via drill 0.2)
  Top 0.254: PROZ1.22 21.58,41.8 21.99,42.2 22.5,42.2 v23.13,41.57
  Bottom 0.254: X2.8 5.1,45.63 7.64,45.63 8.65,44.62 8.65,40.68 9.04,40.3 21.86,40.3 v23.13,41.57
LEM_1  (via drill 0.2)
  Top 0.254: PROZ1.15 9.35,40.3 C18.1 v4.34,34.97
  Bottom 0.254: C18.1 v4.34,34.97 4.34,33.61 D7.P$2 4.29,32.04 R26.2
LEM_2  (via drill 0.2)
  Top 0.254: v6.24,34.97 6.24,36.49 9.55,39.8 PROZ1.13 | D6.P$2 5.35,32.13 5.35,32.55 v6.24,32.55
  Bottom 0.254: C17.1 v6.24,34.97 v6.24,32.55 R25.2
LEM_3  (via drill 0.2)
  Top 0.254: PROZ1.11 9.81,39.3 8.15,37.63 v8.15,34.97
  Bottom 0.254: C16.1 v8.15,34.97 8.19,34.92 D8.P$2 8.19,32.09 R24.2 8.15,32.43
MISO  (via drill 0.2)
  Top 0.254: IC7.11 v77.31,49.95 | IC6.11 v77.31,38.01 76.68,38.65 73.42,38.65 72.14,37.36 X8.P$7 67.6,37.36 66.14,38.82 v63.77,38.82 | IC15.11 v77.31,24.43
  Bottom 0.254: v77.31,24.43 77.31,28.7 77.61,29 77.61,34.33 77.31,34.63 v77.31,38.01 77.31,40.09 76.98,40.43 76.98,49.62 v77.31,49.95 | IC5.11 60.72,41.86 v63.77,38.82
MISO_M  (via drill 0.2)
  Top 0.254: v60.72,37 59.84,37.89 53.74,37.89 53.33,38.3 PROZ1.42
  Bottom 0.254: v60.72,37 IC5.6
MOSI  (via drill 0.2)
  Top 0.254: IC6.2 77.31,28.92 v76.98,29.25 | IC7.2 77.31,40 77.11,39.79 v76.73,39.79 74.44,39.79 73.74,40.49 72.47,40.49 71.85,39.86 X8.P$6 63.97,39.86 v63.65,40.19 | IC15.2 77.23,14.04 v77.23,15.54
  Bottom 0.254: v76.73,39.79 76.73,34.58 76.98,34.33 v76.98,29.25 76.73,29 76.73,24.04 76.98,23.79 76.98,15.79 v77.23,15.54 | IC5.13 63.26,40.57 v63.65,40.19
MOSI_M  (via drill 0.2)
  Top 0.254: v63.26,37 61.87,38.39 53.87,38.39 53.46,38.8 PROZ1.41
  Bottom 0.254: v63.26,37 IC5.4
N$1
  Top 0.254: LED1.C R1.2
N$2
  Top 0.254: LED2.C R2.2
N$3
  Bottom 0.254: R7.1 C5.1 R8.1
N$4  (via drill 0.2)
  Top 0.254: X13.3 19.19,19.99 v19.2,19.98 | R58.1 v20.14,12.36 IC8.5
  Bottom 0.254: 20.08,11.92 C13.1 20.53,12.36 v20.14,12.36 19.58,12.36 19.2,12.74 v19.2,19.98
N$5
  Bottom 0.254: X10.P$3 90.55,31.5 X9.P$4
N$6  (via drill 0.2)
  Top 0.254: IC7.3 v78.31,40.68 | R60.1 84.85,51.35 86.89,49.32 86.89,43.93 X11.P$1
  other vias: 78.31,41.95 78.31,41.32
  pour Bottom (no thermals): 78.17,40.43 79.39,40.43 80.92,41.95 86.12,41.95 86.12,43.47 80.16,43.47 78.89,42.2 78.17,42.2
N$7  (via drill 0.2)
  Top 0.254: v5.86,21.25 X15.2
  Bottom 0.254: R26.1 4.34,22.77 v5.86,21.25
N$9  (via drill 0.2)
  Top 0.254: IC9.5 12.91,12.8 12.85,12.74 v12.85,12.36 14.24,12.36 R57.1 | X14.3 12.45,19.99 v12.46,19.98
  Bottom 0.254: 12.85,11.92 C14.1 | 13.29,12.49 C14.1 | v12.46,19.98 12.46,15.92 11.96,15.41 11.96,12.61 12.21,12.36 v12.85,12.36 13.29,12.36 C14.1
N$10  (via drill 0.2)
  Top 0.254: IC6.9 v79.31,37.25 | R61.1 87.01,51.35 89.05,49.32 89.05,38.47 X10.P$1
  other vias: 79.31,36.62 79.31,37.89
  pour Bottom (no thermals): 79.01,38.27 80.41,38.27 82.95,35.73 86.25,35.73 86.25,34.2 82.44,34.2 80.28,36.36 79.01,36.36
N$11
  Bottom 0.254: X12.P$3 90.55,45.09 X11.P$4
N$12  (via drill 0.2)
  Top 0.254: IC6.3 v78.31,27.6 | R62.1 88.66,50.46 89.55,49.57 89.55,33.01 X9.P$1
  other vias: 78.31,28.24 78.31,26.97
  pour Bottom (no thermals): 78.12,26.71 79.52,26.71 81.04,28.23 86.25,28.23 86.25,29.76 79.39,29.76 78.12,28.49
N$13  (via drill 0.2)
  Top 0.254: v79.31,50.97 IC7.9 | R59.1 83.08,51.03 X12.P$1
  other vias: 79.31,50.33 79.31,51.6
  pour Bottom (no thermals): 79.01,51.98 80.66,51.98 83.2,49.44 86.25,49.44 86.25,47.79 82.57,47.79 80.54,49.95 79.01,49.95
N$14
  Bottom 0.254: R77.2 90.88,17.51 90.31,18.07 90.06,18.07 89.3,18.84 89.23,18.84 R74.1 87.21,19.22 Q13.1
N$15  (via drill 0.2)
  Top 0.254: C2.1 29.54,32.3 v29.1,32.3
  Top 0.406: J3.P$2 20.85,28.49 23.51,31.16 28.4,31.16 C2.1
  Bottom 0.254: IC2.3 v29.1,32.3
N$16  (via drill 0.2)
  Top 0.254: 10.73,5.25 CON4.1 11.86,5.39 v12.63,4.61
  Bottom 0.254: R31.1 v12.63,4.61
N$17
  Bottom 0.254: IC2.8 25.72,35.59 R4.2
N$18
  Bottom 0.254: R5.1 C4.1 R6.1
N$19
  Bottom 0.254: R7.2 SW1.4
N$20
  Bottom 0.254: IC1.8 36.09,34.84 35.32,35.6 35.32,36.8 R3.2
N$21
  Bottom 0.254: R5.2 SW2.3
N$22  (via drill 0.2)
  Top 0.254: CON5.1 6.23,6.27 v7,5.5
  Bottom 0.254: v7,5.5 7,5.54 R33.1
N$23
  Bottom 0.254: R6.2 SW2.4
N$25  (via drill 0.2)
  Top 0.254: CON2.1 21.9,4.99 23.13,4.99 23.43,4.7 v23.43,4.23
  Bottom 0.254: R30.1 v23.43,4.23
N$31  (via drill 0.2)
  Top 0.254: v10.05,21.25 X14.2
  Bottom 0.254: R25.1 6.24,25.06 v10.05,21.25
N$32  (via drill 0.2)
  Top 0.254: IC10.5 6.17,12.93 6.11,12.87 v6.11,12.61 7.38,12.61 R56.1 | v5.86,19.98 X15.3
  Bottom 0.254: 6.11,12.04 C15.1 | v5.86,19.98 5.86,16.17 5.22,15.54 5.22,13.12 5.73,12.61 v6.11,12.61 6.56,12.61 C15.1 | 6.43,12.74 C15.1
N$33  (via drill 0.2)
  Top 0.254: v14.37,21.25 X13.2
  Bottom 0.254: R24.1 8.15,26.33 10.94,23.54 13.35,23.54 14.37,22.52 v14.37,21.25
N$34
  Bottom 0.254: R8.2 SW1.3
N$35  (via drill 0.2)
  Top 0.254: CON3.1 17.66,5.13 17.93,4.87 v17.93,4.36
  Bottom 0.254: R28.1 v17.93,4.36
N$36
  Bottom 0.254: Q3.1 88.65,26.65 R19.1 88.72,26.66 89.43,25.95 89.61,25.95 R20.2
N$37
  Bottom 0.254: Q4.1 86.58,40.43 R22.1 88.66,40.43 90.19,38.9 90.25,38.9 R23.2
N$46
  Top 0.254: LED6.C R59.2
N$47
  Top 0.254: LED7.C R60.2
N$48
  Top 0.254: LED8.C R61.2
N$49
  Top 0.254: LED9.C R62.2
N$54
  Top 0.254: LED10.C 46.75,9.31 R63.2
N$59  (via drill 0.2)
  Top 0.254: X22.P$1 89.36,11.6 93.11,11.6 R72.1
  other vias: 78.31,14.04 78.31,14.68 78.31,13.41
  pour Bottom (no thermals): 78.12,14.9 78.12,13.25 84.85,13.25 86.25,14.65 86.25,16.04 84.22,16.04 83.08,14.9
N$60  (via drill 0.2)
  Top 0.254: X21.P$1 86.95,19.98 91.2,19.98 91.84,19.34 91.84,12.87 R71.1 | v79.31,23.66 IC15.9
  other vias: 79.31,23.03 79.31,24.3
  pour Bottom (no thermals): 79.01,24.55 80.41,24.55 82.82,22.14 86.25,22.14 86.25,20.62 82.31,20.62 80.16,22.77 79.01,22.77
N$61
  Top 0.254: LED12.C R71.2
N$62
  Top 0.254: LED13.C R72.2
N$63
  Bottom 0.254: Q12.1 87.34,13 R76.1 90.25,11.85 90.57,11.85 91.13,11.29 R78.2
NALERT  (via drill 0.2)
  Top 0.254: PROZ1.35 53.46,41.8 54.63,42.97 v55.26,42.97
  Bottom 0.254: R11.2 65.51,50.88 X6.P$2 65.51,48.01 65.04,47.54 57.04,47.54 55.26,45.76 v55.26,42.97
NCS1  (via drill 0.2)
  Top 0.254: X8.P$5 69.58,41.44 61.99,41.44 60.47,42.97 60.47,48.17 59.84,48.81 50.95,48.81 48.28,51.48 48.02,51.48 v47.64,51.86
  Bottom 0.254: IC3.15 v47.64,51.86
NCS2  (via drill 0.2)
  Top 0.254: v46.75,52.49 47.9,52.49 51.07,49.32 59.96,49.32 62.38,46.9 68.46,46.9 X8.P$4
  Bottom 0.254: IC3.14 46.37,52.87 v46.75,52.49
NCS3  (via drill 0.2)
  Top 0.254: v45.48,53.13 47.9,53.13 51.2,49.82 60.09,49.82 62.55,47.36 X8.P$3
  Bottom 0.254: IC3.13 45.1,53.51 v45.48,53.13
NCS4  (via drill 0.2)
  Top 0.254: v43.83,53.76 47.9,53.76 51.33,50.33 68.72,50.33 69.19,49.86 X8.P$2
  Bottom 0.254: IC3.12 v43.83,53.76
NCS6  (via drill 0.2)
  Top 0.254: v41.29,54.4 47.9,54.4 51.45,50.84 68.72,50.84 68.98,51.09 74.57,51.09 75.84,52.36 80.03,52.36 80.31,52.08 IC7.8
  Bottom 0.254: IC3.10 v41.29,54.4
NCS7  (via drill 0.2)
  Top 0.254: v40.02,55.03 47.9,55.03 51.58,51.35 66.69,51.35 69.11,53.76 72.79,53.76 v73.81,52.75 | v73.81,39.54 74.19,39.16 79.77,39.16 80.28,38.65 80.28,37.26 IC6.8
  Bottom 0.254: IC3.9 v40.02,55.03 | v73.81,52.75 v73.81,39.54
NCS8  (via drill 0.2)
  Top 0.254: IC15.8 80.31,22.3 80.16,22.14 75.71,22.14 75.46,22.39 75.46,23.16 73.81,24.81 v73.81,25.82 | v73.17,41.19 72.92,40.93 61.36,40.93 59.96,42.33 59.96,48.05 59.71,48.3 50.82,48.3 50.06,49.06 v41.29,49.06
  Bottom 0.254: v73.81,25.82 73.81,38.52 73.17,39.16 v73.17,41.19 | IC3.7 v41.29,49.06
NFAULT  (via drill 0.2)
  Top 0.254: PROZ1.53 44.98,40.8 43.2,42.59 v43.2,44.74 | v49.8,48.43 44.59,48.43 v43.2,47.03
  Bottom 0.254: R10.2 X6.P$1 62.5,48.43 v49.8,48.43 | v43.2,47.03 v43.2,44.74
NRST
  Top 0.254: PROZ1.17 4.85,40.8 X2.4
RM_KVL1  (via drill 0.2)
  Top 0.254: PROZ1.33 53.19,42.8 54.63,44.24 v56.02,44.24 | v79.27,21.5 75.33,21.5 74.95,21.89 74.95,23.03 72.53,25.44 72.53,27.47 71.52,28.49 63.77,28.49 v62.5,27.22
  Bottom 0.254: Q13.3 84.7,18.07 80.41,18.07 79.65,18.84 79.65,21.12 v79.27,21.5 | v56.02,44.24 56.91,44.24 57.17,43.98 57.17,30.9 61.23,26.84 R73.1 v62.5,27.22
RM_KVL1_EX
  Bottom 0.254: R74.2 90.55,19.56 X21.P$3
RM_KVL2  (via drill 0.2)
  Top 0.254: PROZ1.34 53.33,42.3 54.63,43.6 v56.53,43.6 | v64.53,27.22 65.3,27.98 69.11,27.98 70.25,26.84 70.25,17.19 71.52,15.92 v75.08,15.92
  Bottom 0.254: v56.53,43.6 56.66,43.47 56.66,30.78 61.61,25.82 63.39,25.82 R75.1 64.53,26.96 v64.53,27.22 | Q12.3 78.38,12.23 77.61,13 77.61,14.14 75.84,15.92 v75.08,15.92
RM_KVL2_EX
  Bottom 0.254: R76.2 91.13,14.82 X22.P$3
SCLK  (via drill 0.2)
  Top 0.254: IC7.5 80.31,39.38 80.79,38.9 82.06,38.9 83.33,37.63 83.33,34.97 | 83.33,34.97 83.33,26.2 | 83.33,26.2 83.33,13.76 81.93,12.36 80.79,12.36 80.31,12.84 IC15.5 | IC6.5 80.28,27.66 80.28,26.46 80.54,26.2 83.33,26.2 | 83.33,34.97 71.52,34.97 71.42,34.86 X8.P$8 68.83,34.86 v65.8,37.89
  Bottom 0.254: IC5.14 64.53,39.16 v65.8,37.89
SCLK_M  (via drill 0.2)
  Top 0.254: v64.53,35.85 64.03,36.36 59.33,36.36 58.31,37.38 53.61,37.38 53.19,37.8 PROZ1.60
  Bottom 0.254: v64.53,35.85 IC5.3
SLS_CO1  (via drill 0.2)
  Top 0.254: IC6.4 79.31,26.38 79.14,26.2 75.33,26.2 71.77,29.76 59.71,29.76 v54.63,34.84 | PROZ1.57 46.03,42.8 v45.74,43.09
  Bottom 0.254: v45.74,43.09 46.5,42.33 46.5,34.46 46.88,34.08 53.87,34.08 v54.63,34.84
SLS_RM  (via drill 0.2)
  Top 0.254: PROZ1.56 45.39,42.3 v45.1,42.59 | v54.76,33.82 59.45,29.12 v60.34,29.12 71.77,29.12 75.2,25.7 82.06,25.7 v82.31,25.44
  Bottom 0.254: R18.1 v60.34,29.13 v60.34,29.12 | v45.1,42.59 45.99,41.7 45.99,34.2 46.75,33.44 54.37,33.44 v54.76,33.82 | Q3.3 84.83,25.44 v82.31,25.44
SLS_RM_EX
  Bottom 0.254: X9.P$3 90.55,26.92 R19.2
SPI_CS  (via drill 0.2)
  Top 0.254: PROZ1.38 v54.37,40.3
  Bottom 0.254: IC3.6 42.56,50.08 42.94,50.46 47.77,50.46 48.28,49.95 48.28,45.76 53.74,40.3 v54.37,40.3
TS1  (via drill 0.2)
  Top 0.254: v54.12,39.03 53.85,39.3 PROZ1.40
  Bottom 0.254: R30.2 R29.1 C21.2 25.12,9.19 | 25.12,9.19 D9.P$2 | v54.12,39.03 52.34,39.03 47.64,43.73 45.23,43.73 41.8,40.3 36.47,40.3 34.05,37.89 34.05,31.16 33.04,30.14 33.04,26.33 29.23,22.52 29.23,16.42 27.2,14.39 27.2,10.07 26.31,9.19 25.12,9.19
TS2  (via drill 0.2)
  Top 0.254: v54.88,39.66 54.12,39.66 53.98,39.8 PROZ1.39
  Bottom 0.254: R28.2 R27.1 C20.2 19.66,9.19 | 19.66,9.19 D10.P$2 | 19.66,9.19 19.66,10.16 20.72,11.22 21.48,11.22 22.24,11.98 22.24,16.42 32.53,26.71 32.53,30.39 33.42,31.28 33.42,38.01 36.34,40.93 41.8,40.93 45.1,44.24 47.9,44.24 52.47,39.66 v54.88,39.66
TS3  (via drill 0.2)
  Top 0.254: PROZ1.5 v12.72,37.8
  Bottom 0.254: R31.2 R32.1 C25.2 D1.P$2 14.33,10.79 15.51,11.98 15.51,25.95 17.8,28.23 17.8,33.48 13.48,37.8 v12.72,37.8
TS4  (via drill 0.2)
  Top 0.254: PROZ1.3 13.27,37.3 v13.1,37.12
  Bottom 0.254: R33.2 R34.1 C26.2 D11.P$2 8.74,10.79 9.04,11.09 13.86,11.09 15,12.23 15,26.2 17.16,28.36 17.16,33.06 v13.1,37.12
USART_RXD  (via drill 0.2)
  Top 0.254: PROZ1.30 20.03,43.8 v20.46,44.24 | X2.10 4.97,48.3 6.75,48.3 7.38,48.94 v20.08,48.94
  Bottom 0.254: v20.08,48.94 20.46,48.55 v20.46,44.24
USART_TXD  (via drill 0.2)
  Top 0.254: PROZ1.28 20.8,43.3 v21.1,43.6 | X2.9 v20.59,49.57
  Bottom 0.254: v21.1,43.6 21.1,49.06 v20.59,49.57
VL_CO1  (via drill 0.2)
  Top 0.254: IC15.4 79.31,15.61 78.76,16.17 76.6,16.17 75.58,15.15 71.27,15.15 69.49,16.93 69.49,24.81 68.47,25.82 61.87,25.82 v54.88,32.81 | v45.36,41.44 45.99,41.44 46.13,41.3 PROZ1.54
  Bottom 0.254: v45.36,41.44 45.48,41.32 45.48,33.95 46.63,32.81 v54.88,32.81
VREF_PTC_CH  (via drill 0.2)
  Top 0.254: C22.1 v26.31,12.68 | CON5.2 6.1,7.52 v7,8.42 | CON4.2 11.82,6.64 v12.59,7.41 | CON3.2 17.66,6.38 17.93,6.65 v17.93,7.15 | CON2.2 23.38,6.38 23.51,6.52 v23.51,7.15
  Bottom 0.254: IC11.6 26.18,11.98 26.31,12.11 v26.31,12.68 | C21.1 v23.51,7.15 | C20.1 v17.93,7.15 | v12.59,7.41 C25.1 | v7,8.42 C26.1
  pour Route15 (isolate 0.152, no thermals): 0.5,10.5 0.5,2 2,0.5 27,0.5 27,13.04 26.5,13.54 26.02,13.54 23.02,10.54 22.02,10.54

### Text on the board
Bottom: BMS Master / Ibex / V3.0 | bottom | TERA TU Graz / (Pöschl Rene)
tTest: BMS Master Ibex | GND | TERA TU Graz, Oktober 2015 / Pöschl Rene | FAULT | ALERT | NCS4 | NCS3 | NCS2 | NCS1 | MOSI | Hauptschütz | MISO | CLK | 5V | LEM1 | LEM2 | Charger | LEM3 | R OFF | 3V3 | CAN 2 | 5V | R OFF | CAN 1 | Interlock | TS4 | TS3 | TS2 | TS1 | BMS Master / Version 4 | 12V | GND
bTest: CAN / Transiver | 12V | GND